# Altium project uAMDC.PrjPcb (part 2 of 3)

## Sheet InverterConnectors.SchDoc: Inverter Connectors
size Letter; Engineer: Nathan Petersen; DocumentNumber: 17; Revision: v1.2; SheetNumber: 17; SheetTotal: 26
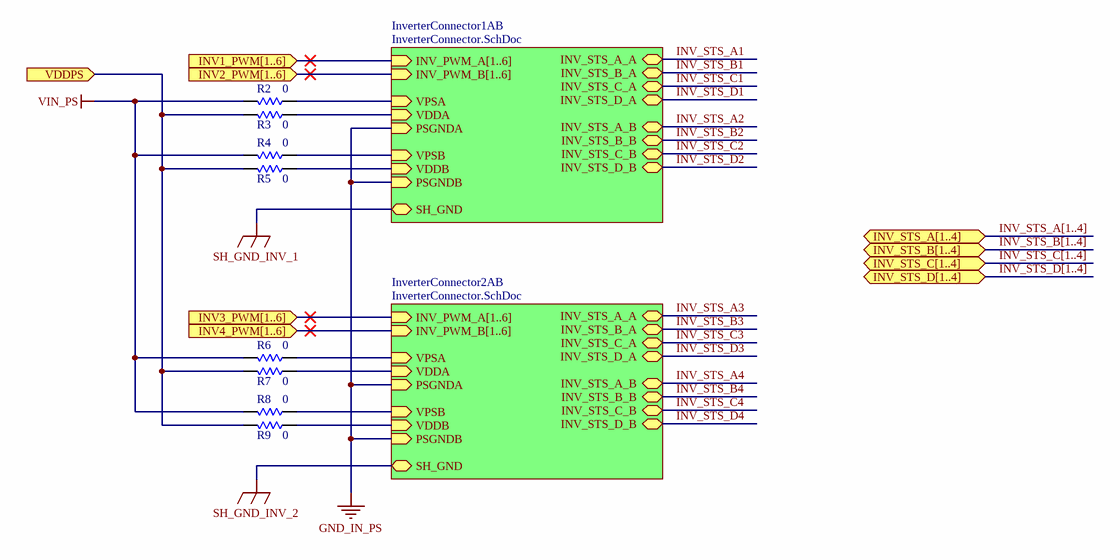
[diagram p11: InverterConnectors.SchDoc]

### Parts
R2  value 0  [1206-RES]  (hidden comment: Resistor)
R3  value 0  [1206-RES]  (hidden comment: Resistor)
R4  value 0  [1206-RES]  (hidden comment: Resistor)
R5  value 0  [1206-RES]  (hidden comment: Resistor)
R6  value 0  [1206-RES]  (hidden comment: Resistor)
R7  value 0  [1206-RES]  (hidden comment: Resistor)
R8  value 0  [1206-RES]  (hidden comment: Resistor)
R9  value 0  [1206-RES]  (hidden comment: Resistor)

### Sub-sheets
InverterConnector1AB = InverterConnector.SchDoc: INV_PWM_A[1..6] (in), INV_PWM_B[1..6] (in), SH_GND (bidir), INV_STS_A_B (bidir), INV_STS_A_A (bidir), INV_STS_B_A (bidir), INV_STS_C_A (bidir), INV_STS_D_A (bidir), INV_STS_B_B (bidir), INV_STS_C_B (bidir), INV_STS_D_B (bidir), VPSA (in), VDDA (in), PSGNDA (in), VPSB (in), VDDB (in), PSGNDB (in)
InverterConnector2AB = InverterConnector.SchDoc: INV_PWM_A[1..6] (in), INV_PWM_B[1..6] (in), SH_GND (bidir), INV_STS_A_B (bidir), INV_STS_A_A (bidir), INV_STS_B_A (bidir), INV_STS_C_A (bidir), INV_STS_D_A (bidir), INV_STS_B_B (bidir), INV_STS_C_B (bidir), INV_STS_D_B (bidir), VPSA (in), VDDA (in), PSGNDA (in), VPSB (in), VDDB (in), PSGNDB (in)

### Ports
INV1_PWM[1..6] (in), INV2_PWM[1..6] (in), INV3_PWM[1..6] (in), INV4_PWM[1..6] (in), INV_STS_A[1..4] (bidir), INV_STS_B[1..4] (bidir), INV_STS_C[1..4] (bidir), INV_STS_D[1..4] (bidir), VDDPS (in)

### Nets
GND_IN_PS: sheet InverterConnector1AB/PSGNDA, sheet InverterConnector1AB/PSGNDB, sheet InverterConnector2AB/PSGNDA, sheet InverterConnector2AB/PSGNDB
VIN_PS: R2.2 R4.2 R6.2 R8.2
VDDPS: R3.2 R5.2 R7.2 R9.2 ; port VDDPS
NetCON3A_12A: R2.1 ; sheet InverterConnector1AB/VPSA
NetCON3A_12B: R4.1 ; sheet InverterConnector1AB/VPSB
NetCON3A_13A: R3.1 ; sheet InverterConnector1AB/VDDA
NetCON3A_13B: R5.1 ; sheet InverterConnector1AB/VDDB
NetCON3B_12A: R6.1 ; sheet InverterConnector2AB/VPSA
NetCON3B_12B: R8.1 ; sheet InverterConnector2AB/VPSB
NetCON3B_13A: R7.1 ; sheet InverterConnector2AB/VDDA
NetCON3B_13B: R9.1 ; sheet InverterConnector2AB/VDDB

### Buses and harness runs
bus INV_STS_A[1..4] = port INV_STS_A[1..4]
bus INV_STS_B[1..4] = port INV_STS_B[1..4]
bus INV_STS_C[1..4] = port INV_STS_C[1..4]
bus INV_STS_D[1..4] = port INV_STS_D[1..4]
bus port INV1_PWM[1..6] = sheet InverterConnector1AB/INV_PWM_A[1..6]
bus port INV2_PWM[1..6] = sheet InverterConnector1AB/INV_PWM_B[1..6]
bus port INV3_PWM[1..6] = sheet InverterConnector2AB/INV_PWM_A[1..6]
bus port INV4_PWM[1..6] = sheet InverterConnector2AB/INV_PWM_B[1..6]

### Notes on the sheet
- Title:
- File:
- Sheet:
- of
- Revision:
- Time:
- Date:
- Engineer:

### Library data of the parts
R2-R9 = Resistor: Supplier 1: Digi-Key; Supplier Part Number 1: 311-0.0ERCT-ND

## Sheet InverterConnector.SchDoc: Inverter Connector
size Letter; Engineer: Nathan Petersen; DocumentNumber: 18; Revision: v1.2; SheetNumber: 18; SheetTotal: 26
Used 2 times, as channels U_FPGA/U_DriveInterface/U_InverterConnectors/InverterConnector1AB, U_FPGA/U_DriveInterface/U_InverterConnectors/InverterConnector2AB. Parts and nets are listed once, with the designators drawn on the sheet.
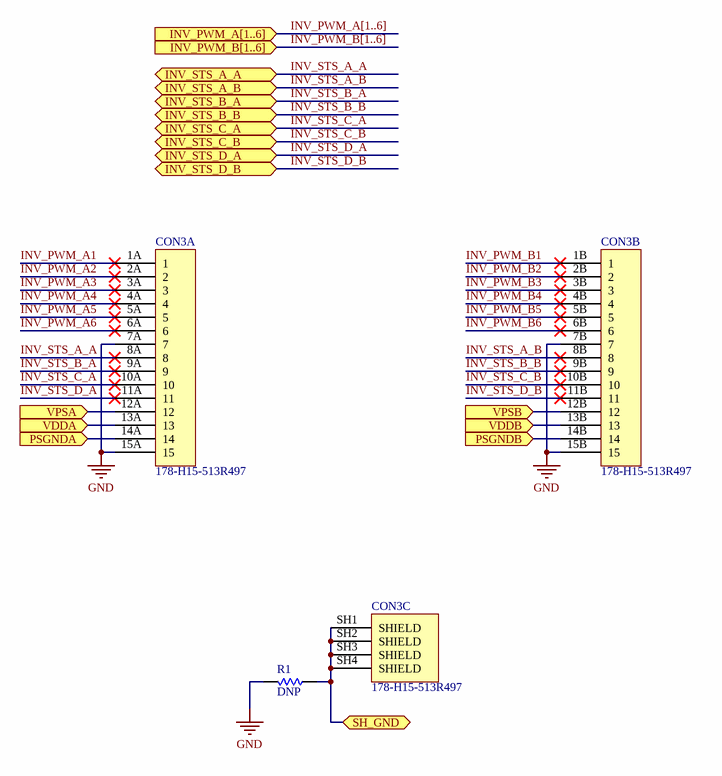
[diagram p12: InverterConnector.SchDoc]

### Parts
CON3  178-H15-513R497  [178-H15-513R497]  (parts A,B,C of 3)
R1  value DNP  [0603-RES]  (hidden comment: Resistor)

### Ports
INV_PWM_A[1..6] (in), INV_PWM_B[1..6] (in), INV_STS_A_A (bidir), INV_STS_A_B (bidir), INV_STS_B_A (bidir), INV_STS_B_B (bidir), INV_STS_C_A (bidir), INV_STS_C_B (bidir), INV_STS_D_A (bidir), INV_STS_D_B (bidir), PSGNDA (in), PSGNDB (in), SH_GND (bidir), VDDA (in), VDDB (in), VPSA (in), VPSB (in)

### Nets
GND: CON3.7A(7) CON3.7B(7) CON3.15A(15) CON3.15B(15) R1.2
INV_PWM_A1: CON3.1A(1)
INV_PWM_A2: CON3.2A(2)
INV_PWM_A3: CON3.3A(3)
INV_PWM_A4: CON3.4A(4)
INV_PWM_A5: CON3.5A(5)
INV_PWM_A6: CON3.6A(6)
INV_PWM_B1: CON3.1B(1)
INV_PWM_B2: CON3.2B(2)
INV_PWM_B3: CON3.3B(3)
INV_PWM_B4: CON3.4B(4)
INV_PWM_B5: CON3.5B(5)
INV_PWM_B6: CON3.6B(6)
INV_STS_A_A: CON3.8A(8) ; port INV_STS_A_A
INV_STS_A_B: CON3.8B(8) ; port INV_STS_A_B
INV_STS_B_A: CON3.9A(9) ; port INV_STS_B_A
INV_STS_B_B: CON3.9B(9) ; port INV_STS_B_B
INV_STS_C_A: CON3.10A(10) ; port INV_STS_C_A
INV_STS_C_B: CON3.10B(10) ; port INV_STS_C_B
INV_STS_D_A: CON3.11A(11) ; port INV_STS_D_A
INV_STS_D_B: CON3.11B(11) ; port INV_STS_D_B
PSGNDA: CON3.14A(14) ; port PSGNDA
PSGNDB: CON3.14B(14) ; port PSGNDB
SH_GND: CON3.SH1(SHIELD) CON3.SH2(SHIELD) CON3.SH3(SHIELD) CON3.SH4(SHIELD) R1.1 ; port SH_GND
VDDA: CON3.13A(13) ; port VDDA
VDDB: CON3.13B(13) ; port VDDB
VPSA: CON3.12A(12) ; port VPSA
VPSB: CON3.12B(12) ; port VPSB

### Channels
U_FPGA/U_DriveInterface/U_InverterConnectors/InverterConnector1AB: designators end in A; ports INV_STS_A_A=INV_STS_A1 INV_STS_A_B=INV_STS_A2 INV_STS_B_A=INV_STS_B1 INV_STS_B_B=INV_STS_B2 INV_STS_C_A=INV_STS_C1 INV_STS_C_B=INV_STS_C2 INV_STS_D_A=INV_STS_D1 INV_STS_D_B=INV_STS_D2 PSGNDA=GND_IN_PS PSGNDB=GND_IN_PS SH_GND=SH_GND_INV_1 VDDA=NetCON3A_13A VDDB=NetCON3A_13B VPSA=NetCON3A_12A VPSB=NetCON3A_12B
U_FPGA/U_DriveInterface/U_InverterConnectors/InverterConnector2AB: designators end in B; ports INV_STS_A_A=INV_STS_A3 INV_STS_A_B=INV_STS_A4 INV_STS_B_A=INV_STS_B3 INV_STS_B_B=INV_STS_B4 INV_STS_C_A=INV_STS_C3 INV_STS_C_B=INV_STS_C4 INV_STS_D_A=INV_STS_D3 INV_STS_D_B=INV_STS_D4 PSGNDA=GND_IN_PS PSGNDB=GND_IN_PS SH_GND=SH_GND_INV_2 VDDA=NetCON3B_13A VDDB=NetCON3B_13B VPSA=NetCON3B_12A VPSB=NetCON3B_12B

### Buses and harness runs
bus INV_PWM_A[1..6] = port INV_PWM_A[1..6]
bus INV_PWM_B[1..6] = port INV_PWM_B[1..6]

### Notes on the sheet
- Title:
- File:
- Sheet:
- of
- Revision:
- Time:
- Date:
- Engineer:

### Library data of the parts
CON3 = 178-H15-513R497: CONN D-SUB RCPT/RCPT 15/15POS RA; Supplier 1: Digi-Key; Supplier Part Number 1: NOR1832-ND
R1 = Resistor: Supplier 1: Digi-Key; Supplier Part Number 1: P0.0GCT-ND

## Sheet InverterTranslation.SchDoc: Inverter Level Translation
size 279 x 215 mm; Engineer: Prasoon Sinha; DocumentNumber: 19; SheetNumber: 19; SheetTotal: 26
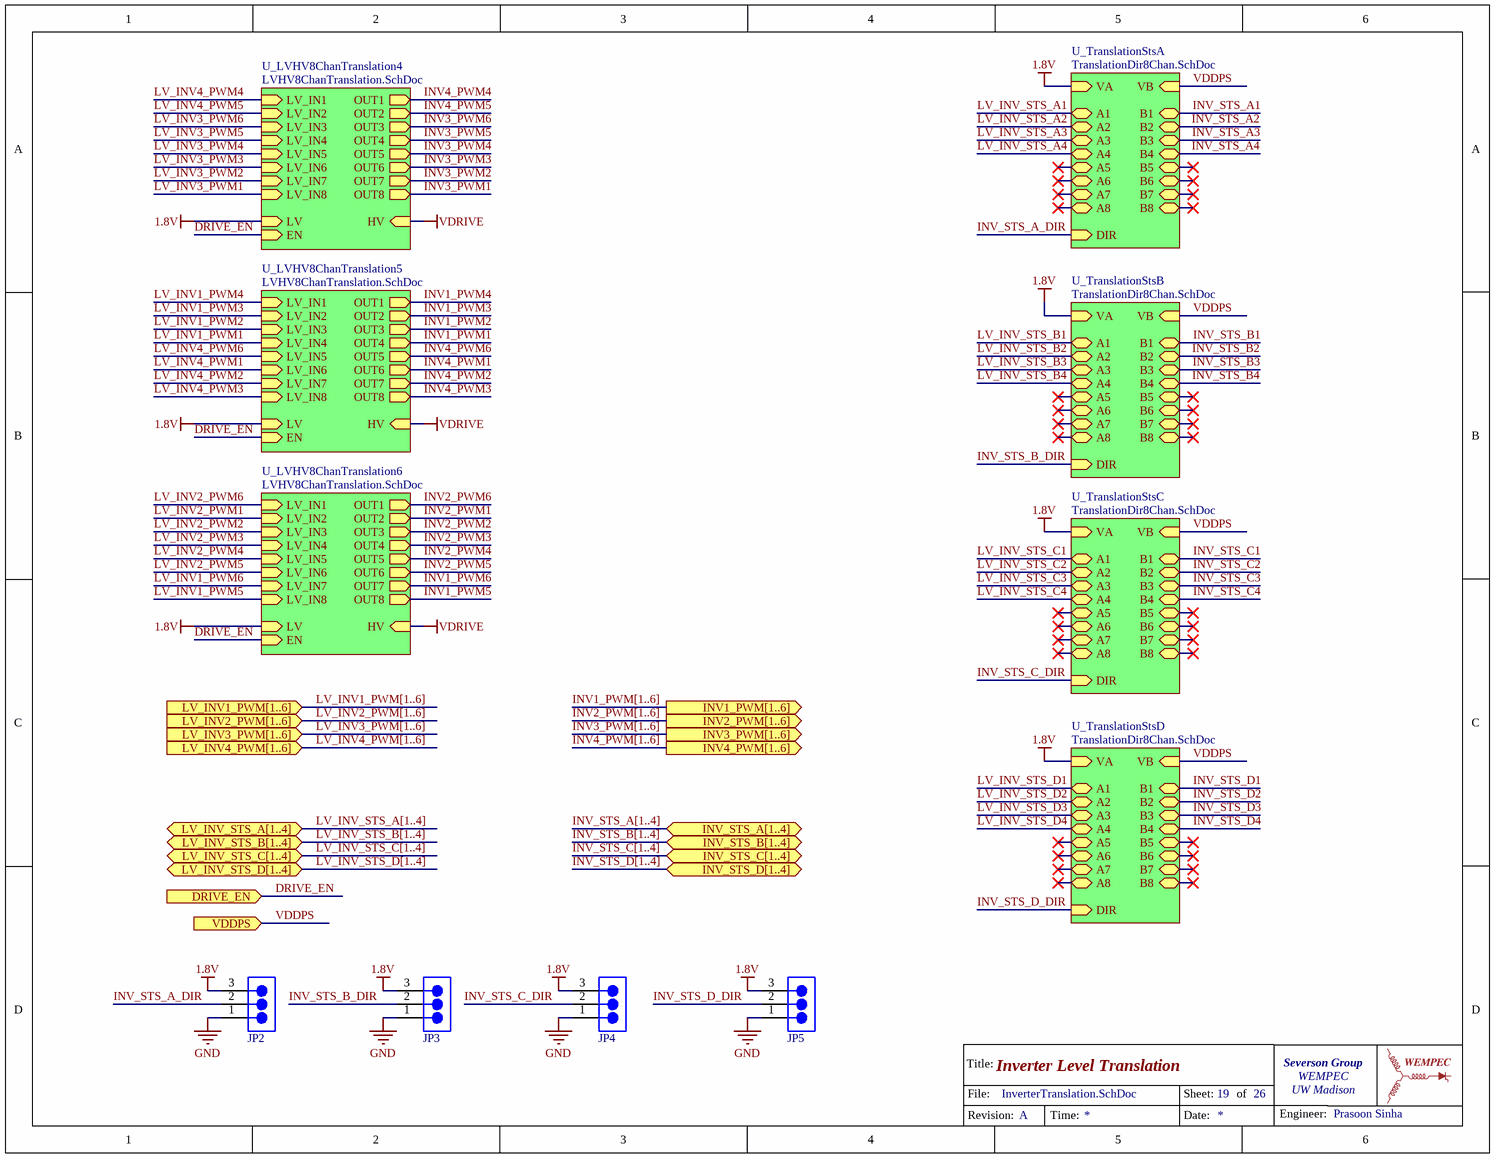
[diagram p13: InverterTranslation.SchDoc]

### Parts
(Parts that share a designator on the sheet are numbered #1, #2 ... from top to bottom, then left to right.)
*?#8  TitleBlockWEMPEC  (value not drawn)  (graphical)
JP2  Jumper3  [PIN_HEADER_1X3]  (value not drawn)
JP3  Jumper3  [PIN_HEADER_1X3]  (value not drawn)
JP4  Jumper3  [PIN_HEADER_1X3]  (value not drawn)
JP5  Jumper3  [PIN_HEADER_1X3]  (value not drawn)

### Sub-sheets
U_LVHV8ChanTranslation4 = LVHV8ChanTranslation.SchDoc: LV_IN1 (in), LV (in), HV (in), EN (in), OUT1 (out), OUT2 (out), OUT3 (out), OUT4 (out), LV_IN2 (in), LV_IN3 (in), LV_IN4 (in), LV_IN5 (in), LV_IN6 (in), LV_IN7 (in), LV_IN8 (in), OUT5 (out), OUT6 (out), OUT7 (out), OUT8 (out)
U_LVHV8ChanTranslation5 = LVHV8ChanTranslation.SchDoc: LV_IN1 (in), LV (in), HV (in), EN (in), OUT1 (out), OUT2 (out), OUT3 (out), OUT4 (out), LV_IN2 (in), LV_IN3 (in), LV_IN4 (in), LV_IN5 (in), LV_IN6 (in), LV_IN7 (in), LV_IN8 (in), OUT5 (out), OUT6 (out), OUT7 (out), OUT8 (out)
U_LVHV8ChanTranslation6 = LVHV8ChanTranslation.SchDoc: LV_IN1 (in), LV (in), HV (in), EN (in), OUT1 (out), OUT2 (out), OUT3 (out), OUT4 (out), LV_IN2 (in), LV_IN3 (in), LV_IN4 (in), LV_IN5 (in), LV_IN6 (in), LV_IN7 (in), LV_IN8 (in), OUT5 (out), OUT6 (out), OUT7 (out), OUT8 (out)
U_TranslationStsA = TranslationDir8Chan.SchDoc: VB (in), VA (in), B1 (bidir), B2 (bidir), B3 (bidir), B4 (bidir), A1 (bidir), A2 (bidir), A3 (bidir), A4 (bidir), DIR (in), B6 (bidir), A7 (bidir), B5 (bidir), A5 (bidir), B7 (bidir), A8 (bidir), A6 (bidir), B8 (bidir)
U_TranslationStsB = TranslationDir8Chan.SchDoc: VB (in), VA (in), B1 (bidir), B2 (bidir), B3 (bidir), B4 (bidir), A1 (bidir), A2 (bidir), A3 (bidir), A4 (bidir), DIR (in), B6 (bidir), A7 (bidir), B5 (bidir), A5 (bidir), B7 (bidir), A8 (bidir), A6 (bidir), B8 (bidir)
U_TranslationStsC = TranslationDir8Chan.SchDoc: VB (in), VA (in), B1 (bidir), B2 (bidir), B3 (bidir), B4 (bidir), A1 (bidir), A2 (bidir), A3 (bidir), A4 (bidir), DIR (in), B6 (bidir), A7 (bidir), B5 (bidir), A5 (bidir), B7 (bidir), A8 (bidir), A6 (bidir), B8 (bidir)
U_TranslationStsD = TranslationDir8Chan.SchDoc: VB (in), VA (in), B1 (bidir), B2 (bidir), B3 (bidir), B4 (bidir), A1 (bidir), A2 (bidir), A3 (bidir), A4 (bidir), DIR (in), B6 (bidir), A7 (bidir), B5 (bidir), A5 (bidir), B7 (bidir), A8 (bidir), A6 (bidir), B8 (bidir)

### Ports
DRIVE_EN (in), INV1_PWM[1..6] (out), INV2_PWM[1..6] (out), INV3_PWM[1..6] (out), INV4_PWM[1..6] (out), INV_STS_A[1..4] (bidir), INV_STS_B[1..4] (bidir), INV_STS_C[1..4] (bidir), INV_STS_D[1..4] (bidir), LV_INV1_PWM[1..6] (in), LV_INV2_PWM[1..6] (in), LV_INV3_PWM[1..6] (in), LV_INV4_PWM[1..6] (in), LV_INV_STS_A[1..4] (bidir), LV_INV_STS_B[1..4] (bidir), LV_INV_STS_C[1..4] (bidir), LV_INV_STS_D[1..4] (bidir), VDDPS (in)

### Nets
1.8V: JP2.3 JP3.3 JP4.3 JP5.3 ; sheet U_LVHV8ChanTranslation4/LV, sheet U_LVHV8ChanTranslation5/LV, sheet U_LVHV8ChanTranslation6/LV, sheet U_TranslationStsA/VA, sheet U_TranslationStsB/VA, sheet U_TranslationStsC/VA, sheet U_TranslationStsD/VA
GND: JP2.1 JP3.1 JP4.1 JP5.1
VDRIVE: sheet U_LVHV8ChanTranslation4/HV, sheet U_LVHV8ChanTranslation5/HV, sheet U_LVHV8ChanTranslation6/HV
DRIVE_EN: port DRIVE_EN, sheet U_LVHV8ChanTranslation4/EN, sheet U_LVHV8ChanTranslation5/EN, sheet U_LVHV8ChanTranslation6/EN
INV_STS_A_DIR: JP2.2 ; sheet U_TranslationStsA/DIR
INV_STS_B_DIR: JP3.2 ; sheet U_TranslationStsB/DIR
INV_STS_C_DIR: JP4.2 ; sheet U_TranslationStsC/DIR
INV_STS_D_DIR: JP5.2 ; sheet U_TranslationStsD/DIR
VDDPS: port VDDPS, sheet U_TranslationStsA/VB, sheet U_TranslationStsB/VB, sheet U_TranslationStsC/VB, sheet U_TranslationStsD/VB

### Buses and harness runs
bus INV1_PWM[1..6] = port INV1_PWM[1..6]
bus INV2_PWM[1..6] = port INV2_PWM[1..6]
bus INV3_PWM[1..6] = port INV3_PWM[1..6]
bus INV4_PWM[1..6] = port INV4_PWM[1..6]
bus INV_STS_A[1..4] = port INV_STS_A[1..4]
bus INV_STS_B[1..4] = port INV_STS_B[1..4]
bus INV_STS_C[1..4] = port INV_STS_C[1..4]
bus INV_STS_D[1..4] = port INV_STS_D[1..4]
bus LV_INV1_PWM[1..6] = port LV_INV1_PWM[1..6]
bus LV_INV2_PWM[1..6] = port LV_INV2_PWM[1..6]
bus LV_INV3_PWM[1..6] = port LV_INV3_PWM[1..6]
bus LV_INV4_PWM[1..6] = port LV_INV4_PWM[1..6]
bus LV_INV_STS_A[1..4] = port LV_INV_STS_A[1..4]
bus LV_INV_STS_B[1..4] = port LV_INV_STS_B[1..4]
bus LV_INV_STS_C[1..4] = port LV_INV_STS_C[1..4]
bus LV_INV_STS_D[1..4] = port LV_INV_STS_D[1..4]

### Notes on the sheet
- (in symbol TitleBlockWEMPEC) Title:; File:; Sheet:; of; Engineer:; Revision:; Time:; Date:

### Library data of the parts
JP2-JP5 = Jumper3: Supplier 1: Digi-Key; Supplier Part Number 1: 732-5316-ND

## Sheet LVHV8ChanTranslation.SchDoc: 8-channel LV to HV Translation
size Letter; Engineer: Prasoon Sinha; DocumentNumber: 20; Revision: v1.2; SheetNumber: 20; SheetTotal: 26
Used 3 times, as channels U_FPGA/U_DriveInterface/U_InverterTranslation/U_LVHV8ChanTranslation4, U_FPGA/U_DriveInterface/U_InverterTranslation/U_LVHV8ChanTranslation5, U_FPGA/U_DriveInterface/U_InverterTranslation/U_LVHV8ChanTranslation6. Parts and nets are listed once, with the designators drawn on the sheet.
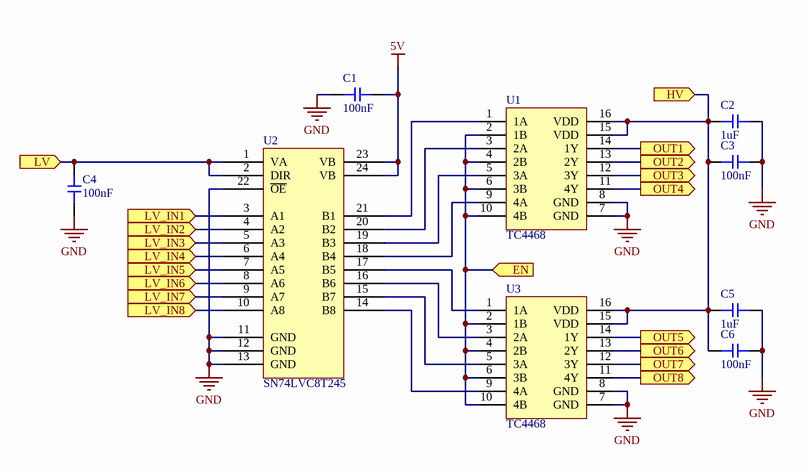
[diagram p14: LVHV8ChanTranslation.SchDoc]

### Parts
C1  value 100nF  [0603-CAP]  (hidden comment: Capacitor)
C2  value 1uF  [0603-CAP]  (hidden comment: Capacitor)
C3  value 100nF  [0603-CAP]  (hidden comment: Capacitor)
C4  value 100nF  [0603-CAP]  (hidden comment: Capacitor)
C5  value 1uF  [0603-CAP]  (hidden comment: Capacitor)
C6  value 100nF  [0603-CAP]  (hidden comment: Capacitor)
U1  TC4468  [SOIC16_N - wide]
U2  SN74LVC8T245  [TSOP65P640X120-24N]
U3  TC4468  [SOIC16_N - wide]

### Ports
EN (in), HV (in), LV (in), LV_IN1 (in), LV_IN2 (in), LV_IN3 (in), LV_IN4 (in), LV_IN5 (in), LV_IN6 (in), LV_IN7 (in), LV_IN8 (in), OUT1 (out), OUT2 (out), OUT3 (out), OUT4 (out), OUT5 (out), OUT6 (out), OUT7 (out), OUT8 (out)

### Nets
5V: C1.1 U2.23(VB) U2.24(VB)
GND: C1.2 C2.2 C3.2 C4.1 C5.2 C6.2 U1.7(GND) U1.8(GND) U2.11(GND) U2.12(GND) U2.13(GND) U2.22(~{OE}) U3.7(GND) U3.8(GND)
EN: U1.2(1B) U1.4(2B) U1.6(3B) U1.10(4B) U3.2(1B) U3.4(2B) U3.6(3B) U3.10(4B) ; port EN
HV: C2.1 C3.1 C5.1 C6.1 U1.15(VDD) U1.16(VDD) U3.15(VDD) U3.16(VDD) ; port HV
LV: C4.2 U2.1(VA) U2.2(DIR) ; port LV
LV_IN1: U2.3(A1) ; port LV_IN1
LV_IN2: U2.4(A2) ; port LV_IN2
LV_IN3: U2.5(A3) ; port LV_IN3
LV_IN4: U2.6(A4) ; port LV_IN4
LV_IN5: U2.7(A5) ; port LV_IN5
LV_IN6: U2.8(A6) ; port LV_IN6
LV_IN7: U2.9(A7) ; port LV_IN7
LV_IN8: U2.10(A8) ; port LV_IN8
OUT1: U1.14(1Y) ; port OUT1
OUT2: U1.13(2Y) ; port OUT2
OUT3: U1.12(3Y) ; port OUT3
OUT4: U1.11(4Y) ; port OUT4
OUT5: U3.14(1Y) ; port OUT5
OUT6: U3.13(2Y) ; port OUT6
OUT7: U3.12(3Y) ; port OUT7
OUT8: U3.11(4Y) ; port OUT8
NetU1_1: U1.1(1A) U2.21(B1)
NetU1_3: U1.3(2A) U2.20(B2)
NetU1_5: U1.5(3A) U2.19(B3)
NetU1_9: U1.9(4A) U2.18(B4)
NetU2_14: U2.14(B8) U3.9(4A)
NetU2_15: U2.15(B7) U3.5(3A)
NetU2_16: U2.16(B6) U3.3(2A)
NetU2_17: U2.17(B5) U3.1(1A)

### Channels
U_FPGA/U_DriveInterface/U_InverterTranslation/U_LVHV8ChanTranslation4: designators end in A; ports EN=DRIVE_EN HV=VDRIVE LV=1.8V LV_IN1=LV_INV4_PWM4 LV_IN2=LV_INV4_PWM5 LV_IN3=LV_INV3_PWM6 LV_IN4=LV_INV3_PWM5 LV_IN5=LV_INV3_PWM4 LV_IN6=LV_INV3_PWM3 LV_IN7=LV_INV3_PWM2 LV_IN8=LV_INV3_PWM1 OUT1=INV4_PWM4 OUT2=INV4_PWM5 OUT3=INV3_PWM6 OUT4=INV3_PWM5 OUT5=INV3_PWM4 OUT6=INV3_PWM3 OUT7=INV3_PWM2 OUT8=INV3_PWM1
U_FPGA/U_DriveInterface/U_InverterTranslation/U_LVHV8ChanTranslation5: designators end in B; ports EN=DRIVE_EN HV=VDRIVE LV=1.8V LV_IN1=LV_INV1_PWM4 LV_IN2=LV_INV1_PWM3 LV_IN3=LV_INV1_PWM2 LV_IN4=LV_INV1_PWM1 LV_IN5=LV_INV4_PWM6 LV_IN6=LV_INV4_PWM1 LV_IN7=LV_INV4_PWM2 LV_IN8=LV_INV4_PWM3 OUT1=INV1_PWM4 OUT2=INV1_PWM3 OUT3=INV1_PWM2 OUT4=INV1_PWM1 OUT5=INV4_PWM6 OUT6=INV4_PWM1 OUT7=INV4_PWM2 OUT8=INV4_PWM3
U_FPGA/U_DriveInterface/U_InverterTranslation/U_LVHV8ChanTranslation6: designators end in C; ports EN=DRIVE_EN HV=VDRIVE LV=1.8V LV_IN1=LV_INV2_PWM6 LV_IN2=LV_INV2_PWM1 LV_IN3=LV_INV2_PWM2 LV_IN4=LV_INV2_PWM3 LV_IN5=LV_INV2_PWM4 LV_IN6=LV_INV2_PWM5 LV_IN7=LV_INV1_PWM6 LV_IN8=LV_INV1_PWM5 OUT1=INV2_PWM6 OUT2=INV2_PWM1 OUT3=INV2_PWM2 OUT4=INV2_PWM3 OUT5=INV2_PWM4 OUT6=INV2_PWM5 OUT7=INV1_PWM6 OUT8=INV1_PWM5

### Notes on the sheet
- Title:
- File:
- Sheet:
- of
- Revision:
- Time:
- Date:
- Engineer:

### Library data of the parts
U1 U3 = TC4468: IC MOSFET DVR QUAD AND 16SOIC; Supplier 1: Digi-Key; Supplier Part Number 1: TC4468COE-ND
U2 = SN74LVC8T245PWR: IC BUS TRANSCVR 8BIT 24TSSOP; Supplier 1: Digi-Key; Supplier Part Number 1: 296-18593-1-ND
C1-C6 = Capacitor: Supplier 1: Digi-Key
  C1 C3 C4 C6: Supplier Part Number 1: 1276-1012-1-ND
  C2 C5: Supplier Part Number 1: 1276-6524-1-ND

## Sheet AnalogInterface.SchDoc: Analog Interface
size Letter; Engineer: Nathan Petersen; DocumentNumber: 11; Revision: v1.2; SheetNumber: 11; SheetTotal: 26
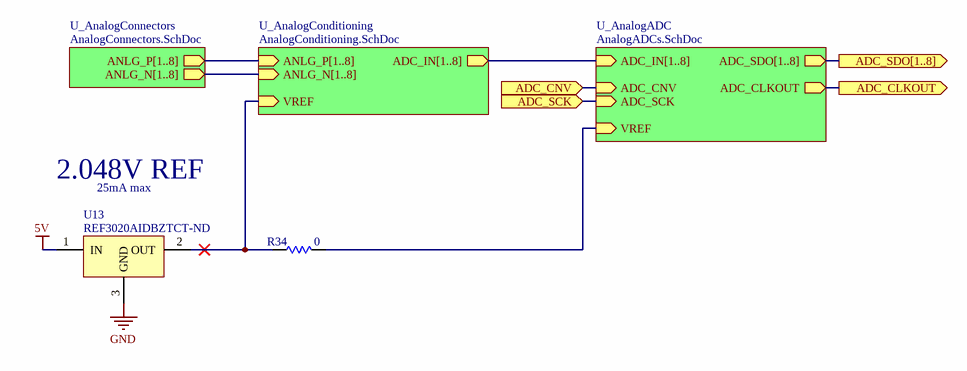
[diagram p15: AnalogInterface.SchDoc]

### Parts
R34  value 0  [1206-RES]  (hidden comment: Resistor)
U13  Supplier Part Number 1: REF3020AIDBZTCT-ND  [SOT23-3]  (hidden comment: REF3020AIDBZT)

### Sub-sheets
U_AnalogADC = AnalogADCs.SchDoc: ADC_IN[1..8] (in), ADC_SDO[1..8] (out), ADC_CNV (in), ADC_SCK (in), ADC_CLKOUT (out), VREF (in)
U_AnalogConditioning = AnalogConditioning.SchDoc: ADC_IN[1..8] (out), ANLG_N[1..8] (in), ANLG_P[1..8] (in), VREF (in)
U_AnalogConnectors = AnalogConnectors.SchDoc: ANLG_P[1..8] (out), ANLG_N[1..8] (out)

### Ports
ADC_CLKOUT (out), ADC_CNV (in), ADC_SCK (in), ADC_SDO[1..8] (out)

### Nets
5V: U13.1(IN)
GND: U13.3(GND)
ADC_CLKOUT: port ADC_CLKOUT, sheet U_AnalogADC/ADC_CLKOUT
ADC_CNV: port ADC_CNV, sheet U_AnalogADC/ADC_CNV
ADC_SCK: port ADC_SCK, sheet U_AnalogADC/ADC_SCK
VREF: R34.2 ; sheet U_AnalogADC/VREF
NetR21_1: R34.1 U13.2(OUT) ; sheet U_AnalogConditioning/VREF

### Buses and harness runs
bus port ADC_SDO[1..8] = sheet U_AnalogADC/ADC_SDO[1..8]
bus sheet U_AnalogADC/ADC_IN[1..8] = sheet U_AnalogConditioning/ADC_IN[1..8]
bus sheet U_AnalogConditioning/ANLG_N[1..8] = sheet U_AnalogConnectors/ANLG_N[1..8]
bus sheet U_AnalogConditioning/ANLG_P[1..8] = sheet U_AnalogConnectors/ANLG_P[1..8]

### Notes on the sheet
- 2.048V REF
- 25mA max
- Title:
- File:
- Sheet:
- of
- Revision:
- Time:
- Date:
- Engineer:

### Library data of the parts
U13 = REF3020AIDBZT: Series Voltage Reference IC ±0.2% 25mA SOT-23-3; Supplier 1: Digi-Key
R34 = Resistor: Supplier 1: Digi-Key; Supplier Part Number 1: 311-0.0ERCT-ND

## Sheet AnalogADCs.SchDoc: ADC
size Letter; Engineer: Nathan Petersen; DocumentNumber: 12; Revision: v1.2; SheetNumber: 12; SheetTotal: 26
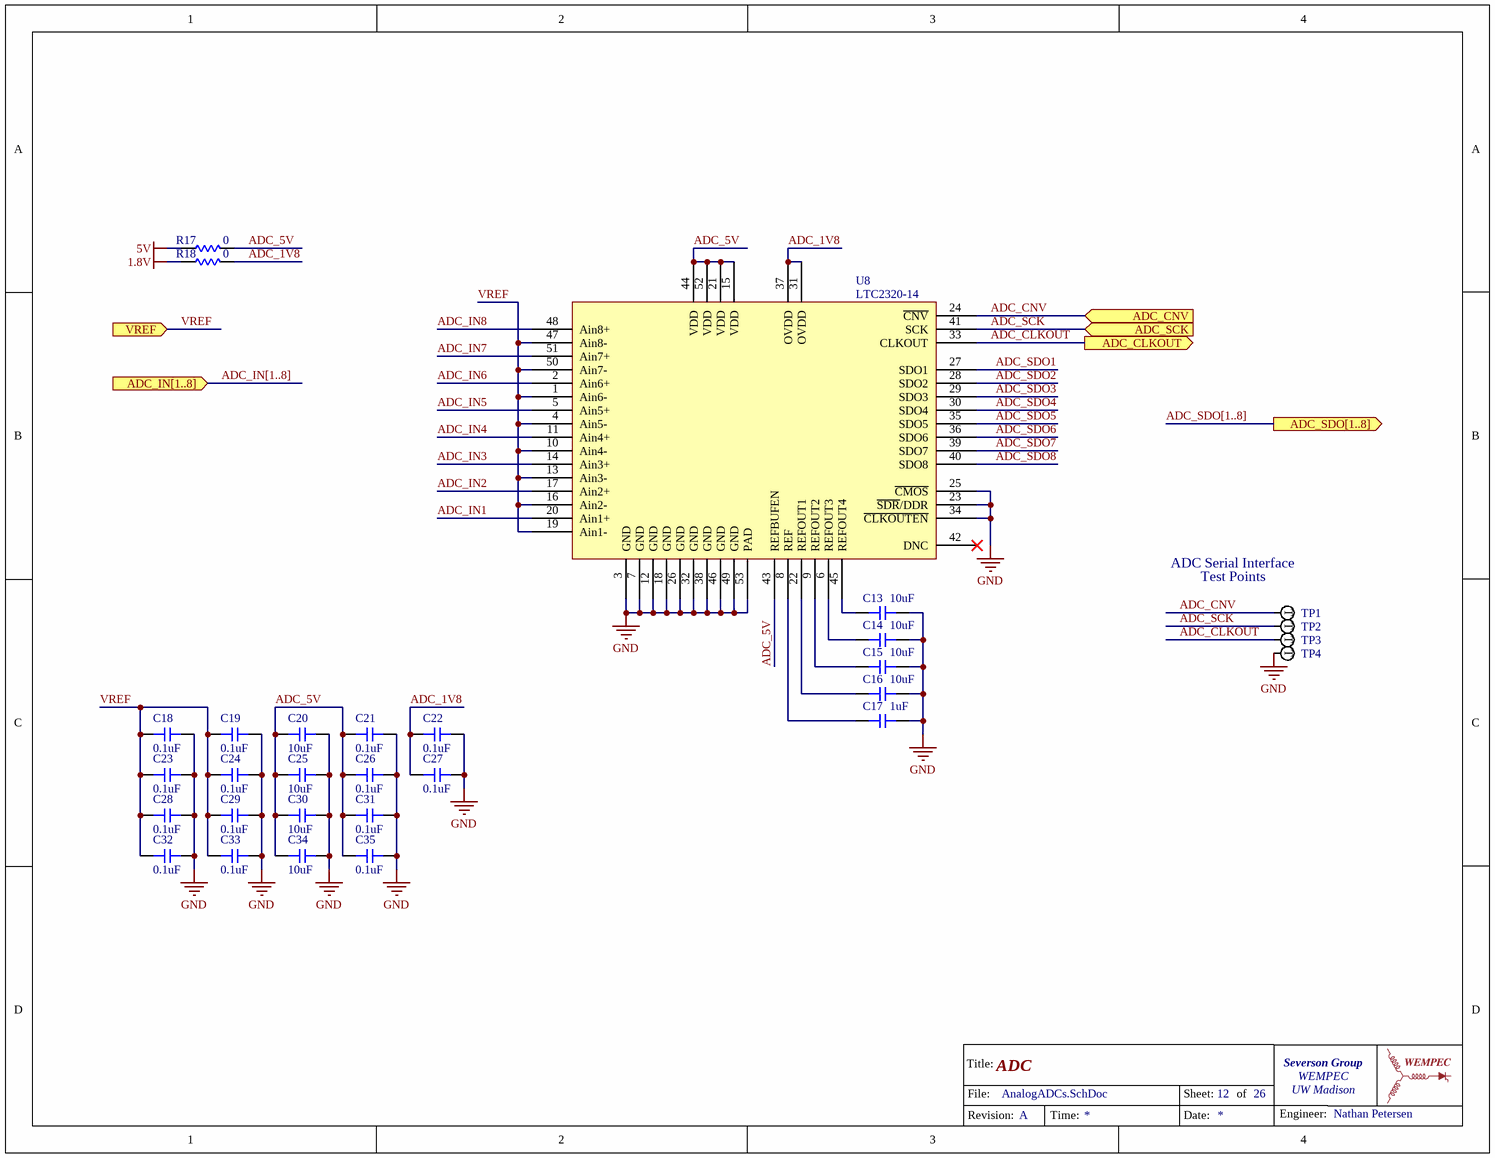
[diagram p16: AnalogADCs.SchDoc]

### Parts
C13  value 10uF  [0603-CAP]  (hidden comment: Capacitor)
C14  value 10uF  [0603-CAP]  (hidden comment: Capacitor)
C15  value 10uF  [0603-CAP]  (hidden comment: Capacitor)
C16  value 10uF  [0603-CAP]  (hidden comment: Capacitor)
C17  value 1uF  [0603-CAP]  (hidden comment: Capacitor)
C18  value 0.1uF  [0603-CAP]  (hidden comment: Capacitor)
C19  value 0.1uF  [0603-CAP]  (hidden comment: Capacitor)
C20  value 10uF  [0603-CAP]  (hidden comment: Capacitor)
C21  value 0.1uF  [0603-CAP]  (hidden comment: Capacitor)
C22  value 0.1uF  [0603-CAP]  (hidden comment: Capacitor)
C23  value 0.1uF  [0603-CAP]  (hidden comment: Capacitor)
C24  value 0.1uF  [0603-CAP]  (hidden comment: Capacitor)
C25  value 10uF  [0603-CAP]  (hidden comment: Capacitor)
C26  value 0.1uF  [0603-CAP]  (hidden comment: Capacitor)
C27  value 0.1uF  [0603-CAP]  (hidden comment: Capacitor)
C28  value 0.1uF  [0603-CAP]  (hidden comment: Capacitor)
C29  value 0.1uF  [0603-CAP]  (hidden comment: Capacitor)
C30  value 10uF  [0603-CAP]  (hidden comment: Capacitor)
C31  value 0.1uF  [0603-CAP]  (hidden comment: Capacitor)
C32  value 0.1uF  [0603-CAP]  (hidden comment: Capacitor)
C33  value 0.1uF  [0603-CAP]  (hidden comment: Capacitor)
C34  value 10uF  [0603-CAP]  (hidden comment: Capacitor)
C35  value 0.1uF  [0603-CAP]  (hidden comment: Capacitor)
R17  value 0  [1206-RES]  (hidden comment: Resistor)
R18  value 0  [1206-RES]  (hidden comment: Resistor)
TP1  Test Point  [RCU-0C]  (value not drawn)
TP2  Test Point  [RCU-0C]  (value not drawn)
TP3  Test Point  [RCU-0C]  (value not drawn)
TP4  Test Point  [RCU-0C]  (value not drawn)
U8  LTC2320-14  [QFN50P700X800X80_HS-53N]

### Ports
ADC_CLKOUT (out), ADC_CNV (in), ADC_IN[1..8] (in), ADC_SCK (in), ADC_SDO[1..8] (out), VREF (in)

### Nets
1.8V: R18.1
5V: R17.1
GND: C13.2 C14.2 C15.2 C16.2 C17.2 C18.2 C19.2 C20.2 C21.2 C22.2 C23.2 C24.2 C25.2 C26.2 C27.2 C28.2 C29.2 C30.2 C31.2 C32.2 C33.2 C34.2 C35.2 TP4.1 U8.3(GND) U8.7(GND) U8.12(GND) U8.18(GND) U8.23(~{SDR}/DDR) U8.25(~{CMOS}) U8.26(GND) U8.32(GND) U8.34(~{CLKOUTEN}) U8.38(GND) U8.46(GND) U8.49(GND) U8.53(PAD)
ADC_1V8: C22.1 C27.1 R18.2 U8.31(OVDD) U8.37(OVDD)
ADC_5V: C20.1 C21.1 C25.1 C26.1 C30.1 C31.1 C34.1 C35.1 R17.2 U8.15(VDD) U8.21(VDD) U8.43(REFBUFEN) U8.44(VDD) U8.52(VDD)
ADC_CLKOUT: TP3.1 U8.33(CLKOUT) ; port ADC_CLKOUT
ADC_CNV: TP1.1 U8.24(~{CNV}) ; port ADC_CNV
ADC_IN1: U8.20(Ain1+)
ADC_IN2: U8.17(Ain2+)
ADC_IN3: U8.14(Ain3+)
ADC_IN4: U8.11(Ain4+)
ADC_IN5: U8.5(Ain5+)
ADC_IN6: U8.2(Ain6+)
ADC_IN7: U8.51(Ain7+)
ADC_IN8: U8.48(Ain8+)
ADC_SCK: TP2.1 U8.41(SCK) ; port ADC_SCK
ADC_SDO1: U8.27(SDO1)
ADC_SDO2: U8.28(SDO2)
ADC_SDO3: U8.29(SDO3)
ADC_SDO4: U8.30(SDO4)
ADC_SDO5: U8.35(SDO5)
ADC_SDO6: U8.36(SDO6)
ADC_SDO7: U8.39(SDO7)
ADC_SDO8: U8.40(SDO8)
VREF: C18.1 C19.1 C23.1 C24.1 C28.1 C29.1 C32.1 C33.1 U8.1(Ain6-) U8.4(Ain5-) U8.10(Ain4-) U8.13(Ain3-) U8.16(Ain2-) U8.19(Ain1-) U8.47(Ain8-) U8.50(Ain7-) ; port VREF
NetC13_1: C13.1 U8.45(REFOUT4)
NetC14_1: C14.1 U8.6(REFOUT3)
NetC15_1: C15.1 U8.9(REFOUT2)
NetC16_1: C16.1 U8.22(REFOUT1)
NetC17_1: C17.1 U8.8(REF)

Not connected (* = marked no-connect by the designer): U8 42(DNC)*

### Buses and harness runs
bus ADC_IN[1..8] = port ADC_IN[1..8]
bus ADC_SDO[1..8] = port ADC_SDO[1..8]

### Notes on the sheet
- ADC Serial Interface
- Test Points
- Title:
- File:
- Sheet:
- of
- Revision:
- Time:
- Date:
- Engineer:
- (in symbol Test Point) T

### Library data of the parts
U8 = LTC2320-14: IC ADC 14BIT 1.5MSPS SAR 52QFN - 14 Bit Analog to Digital Converter 8 Input 4 SAR 52-QFN (7x8); Supplier 1: Digi-Key; Supplier Part Number 1: LTC2320CUKG-14#PBF-ND
C13-C35 = Capacitor: Supplier 1: Digi-Key
  C13: Supplier Part Number 1: 1276-1192-1-ND
  C14-C16 C20 C25 C30 C34: Supplier Part Number 1: 1276-1119-1-ND
  C17: Supplier Part Number 1: 1276-6524-1-ND
  C18 C19 C21-C24 C26-C29 C31-C33 C35: Supplier Part Number 1: 1276-1012-1-ND
R17 R18 = Resistor: Supplier 1: Digi-Key; Supplier Part Number 1: 311-0.0ERCT-ND
TP1-TP4 = Test Point: Footprint: *; Supplier 1: Digi-Key; Supplier Part Number 1: A106145CT-ND

## Sheet AnalogConnectors.SchDoc: Analog RJ45 Connectors
size Letter; Engineer: Nathan Petersen; DocumentNumber: 15; Revision: v1.2; SheetNumber: 15; SheetTotal: 26
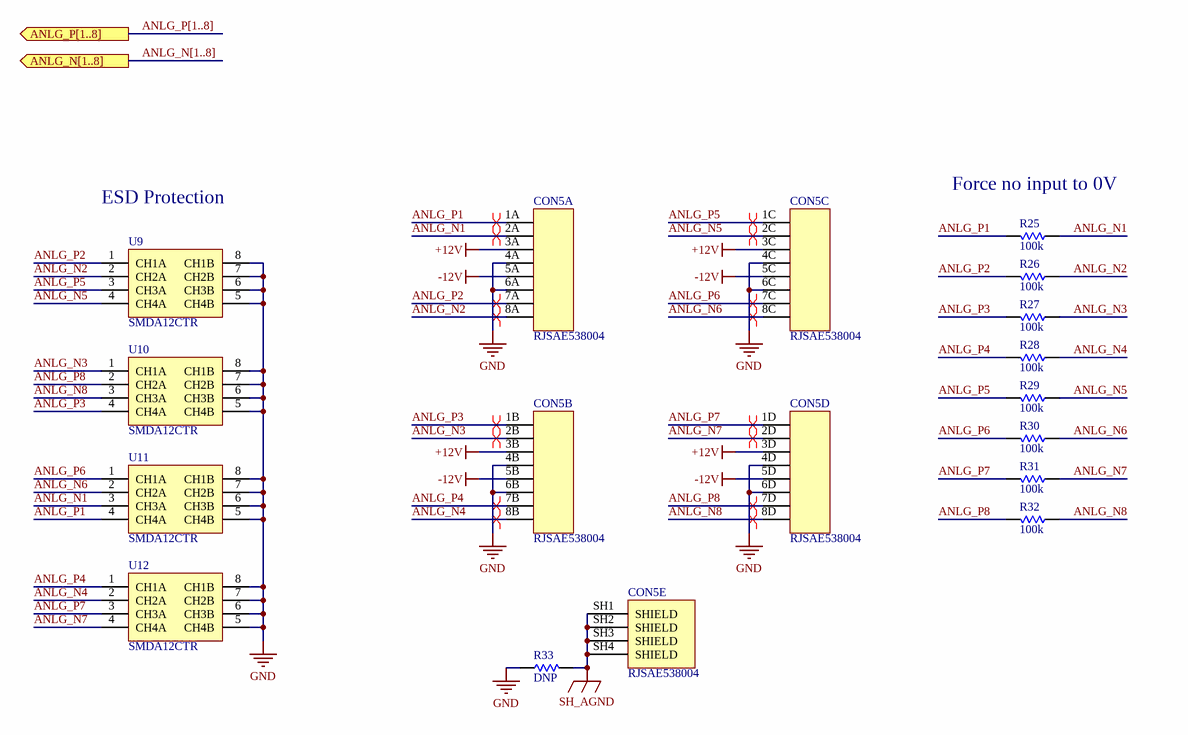
[diagram p17: AnalogConnectors.SchDoc]

### Parts
CON5  RJSAE538004  [RJSAE538004]  (parts A,B,C,D,E of 5)
R25  value 100k  [0603-RES]  (hidden comment: Resistor)
R26  value 100k  [0603-RES]  (hidden comment: Resistor)
R27  value 100k  [0603-RES]  (hidden comment: Resistor)
R28  value 100k  [0603-RES]  (hidden comment: Resistor)
R29  value 100k  [0603-RES]  (hidden comment: Resistor)
R30  value 100k  [0603-RES]  (hidden comment: Resistor)
R31  value 100k  [0603-RES]  (hidden comment: Resistor)
R32  value 100k  [0603-RES]  (hidden comment: Resistor)
R33  value DNP  [0603-RES]  (hidden comment: Resistor)
U9  SMDA12CTR  [SOIC127P600X175-8N]
U10  SMDA12CTR  [SOIC127P600X175-8N]
U11  SMDA12CTR  [SOIC127P600X175-8N]
U12  SMDA12CTR  [SOIC127P600X175-8N]

### Ports
ANLG_N[1..8] (out), ANLG_P[1..8] (out)

### Nets
+12V: CON5.3A CON5.3B CON5.3C CON5.3D
-12V: CON5.5A CON5.5B CON5.5C CON5.5D
GND: CON5.4A CON5.4B CON5.4C CON5.4D CON5.6A CON5.6B CON5.6C CON5.6D R33.1 U9.5(CH4B) U9.6(CH3B) U9.7(CH2B) U9.8(CH1B) U10.5(CH4B) U10.6(CH3B) U10.7(CH2B) U10.8(CH1B) U11.5(CH4B) U11.6(CH3B) U11.7(CH2B) U11.8(CH1B) U12.5(CH4B) U12.6(CH3B) U12.7(CH2B) U12.8(CH1B)
SH_AGND: CON5.SH1(SHIELD) CON5.SH2(SHIELD) CON5.SH3(SHIELD) CON5.SH4(SHIELD) R33.2
ANLG_N1: CON5.2A R25.1 U11.3(CH3A)
ANLG_N2: CON5.8A R26.1 U9.2(CH2A)
ANLG_N3: CON5.2B R27.1 U10.1(CH1A)
ANLG_N4: CON5.8B R28.1 U12.2(CH2A)
ANLG_N5: CON5.2C R29.1 U9.4(CH4A)
ANLG_N6: CON5.8C R30.1 U11.2(CH2A)
ANLG_N7: CON5.2D R31.1 U12.4(CH4A)
ANLG_N8: CON5.8D R32.1 U10.3(CH3A)
ANLG_P1: CON5.1A R25.2 U11.4(CH4A)
ANLG_P2: CON5.7A R26.2 U9.1(CH1A)
ANLG_P3: CON5.1B R27.2 U10.4(CH4A)
ANLG_P4: CON5.7B R28.2 U12.1(CH1A)
ANLG_P5: CON5.1C R29.2 U9.3(CH3A)
ANLG_P6: CON5.7C R30.2 U11.1(CH1A)
ANLG_P7: CON5.1D R31.2 U12.3(CH3A)
ANLG_P8: CON5.7D R32.2 U10.2(CH2A)

### Buses and harness runs
bus ANLG_N[1..8] = port ANLG_N[1..8]
bus ANLG_P[1..8] = port ANLG_P[1..8]

### Layout directives
differential pair: ANLG_N1, ANLG_N2, ANLG_N3, ANLG_N4, ANLG_N5, ANLG_N6, ANLG_N7, ANLG_N8, ANLG_P1, ANLG_P2, ANLG_P3, ANLG_P4, ANLG_P5, ANLG_P6, ANLG_P7, ANLG_P8

### Notes on the sheet
- ESD Protection
- (near R25) Force no input to 0V
- Title:
- File:
- Sheet:
- of
- Revision:
- Time:
- Date:
- Engineer:

### Library data of the parts
CON5 = RJSAE538004: CONN MOD JACK 8P8C R/A SHIELDED; Supplier 1: Digi-Key; Supplier Part Number 1: RJSAE538004-ND
U9-U12 = SMDA12CTR: TVS DIODE 12V 19V 8SO; Supplier 1: Digi-Key; Supplier Part Number 1: 1655-1701-1-ND
R25-R33 = Resistor: Supplier 1: Digi-Key
  R25-R32: Supplier Part Number 1: 311-100KLDCT-ND
  R33: Supplier Part Number 1: P0.0GCT-ND

## Sheet AnalogConditioning.SchDoc: Analog Signal Conditioning
size Letter; Engineer: Nathan Petersen; DocumentNumber: 13; Revision: v1.2; SheetNumber: 13; SheetTotal: 26
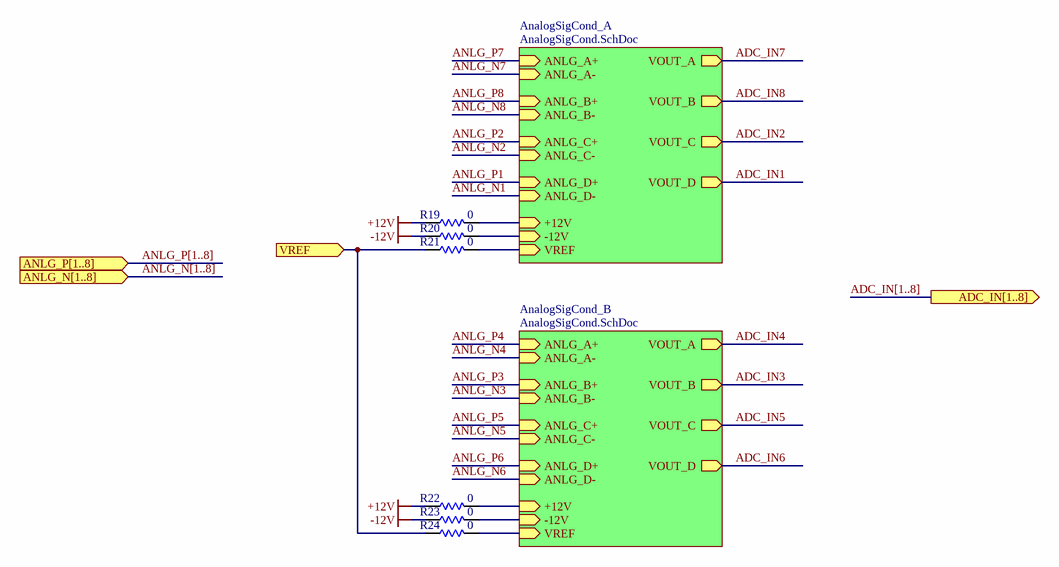
[diagram p18: AnalogConditioning.SchDoc]

### Parts
R19  value 0  [1206-RES]  (hidden comment: Resistor)
R20  value 0  [1206-RES]  (hidden comment: Resistor)
R21  value 0  [1206-RES]  (hidden comment: Resistor)
R22  value 0  [1206-RES]  (hidden comment: Resistor)
R23  value 0  [1206-RES]  (hidden comment: Resistor)
R24  value 0  [1206-RES]  (hidden comment: Resistor)

### Sub-sheets
AnalogSigCond_A = AnalogSigCond.SchDoc: +12V (in), -12V (in), VREF (in), ANLG_A+ (in), ANLG_A- (in), ANLG_B+ (in), ANLG_B- (in), ANLG_C+ (in), ANLG_C- (in), ANLG_D+ (in), ANLG_D- (in), VOUT_A (out), VOUT_B (out), VOUT_C (out), VOUT_D (out)
AnalogSigCond_B = AnalogSigCond.SchDoc: +12V (in), -12V (in), VREF (in), ANLG_A+ (in), ANLG_A- (in), ANLG_B+ (in), ANLG_B- (in), ANLG_C+ (in), ANLG_C- (in), ANLG_D+ (in), ANLG_D- (in), VOUT_A (out), VOUT_B (out), VOUT_C (out), VOUT_D (out)

### Ports
ADC_IN[1..8] (out), ANLG_N[1..8] (in), ANLG_P[1..8] (in), VREF (in)

### Nets
+12V: R19.1 R22.1
-12V: R20.1 R23.1
+12V: R19.2 ; sheet AnalogSigCond_A/+12V  [a separate net that carries the same name]
+12V: R22.2 ; sheet AnalogSigCond_B/+12V  [a separate net that carries the same name]
-12V: R20.2 ; sheet AnalogSigCond_A/-12V  [a separate net that carries the same name]
-12V: R23.2 ; sheet AnalogSigCond_B/-12V  [a separate net that carries the same name]
VREF: R21.2 ; sheet AnalogSigCond_A/VREF
VREF: R24.2 ; sheet AnalogSigCond_B/VREF  [a separate net that carries the same name]
NetR21_1: R21.1 R24.1 ; port VREF

### Buses and harness runs
bus ADC_IN[1..8] = port ADC_IN[1..8]
bus ANLG_N[1..8] = port ANLG_N[1..8]
bus ANLG_P[1..8] = port ANLG_P[1..8]

### Notes on the sheet
- Title:
- File:
- Sheet:
- of
- Revision:
- Time:
- Date:
- Engineer:

### Library data of the parts
R19-R24 = Resistor: Supplier 1: Digi-Key; Supplier Part Number 1: 311-0.0ERCT-ND

## Sheet AnalogSigCond.SchDoc: Analog Signal Front-End
size Letter; Engineer: Nathan Petersen; DocumentNumber: 14; Revision: v1.2; SheetNumber: 14; SheetTotal: 26
Used 2 times, as channels U_FPGA/U_AnalogInterface/U_AnalogConditioning/AnalogSigCond_A, U_FPGA/U_AnalogInterface/U_AnalogConditioning/AnalogSigCond_B. Parts and nets are listed once, with the designators drawn on the sheet.
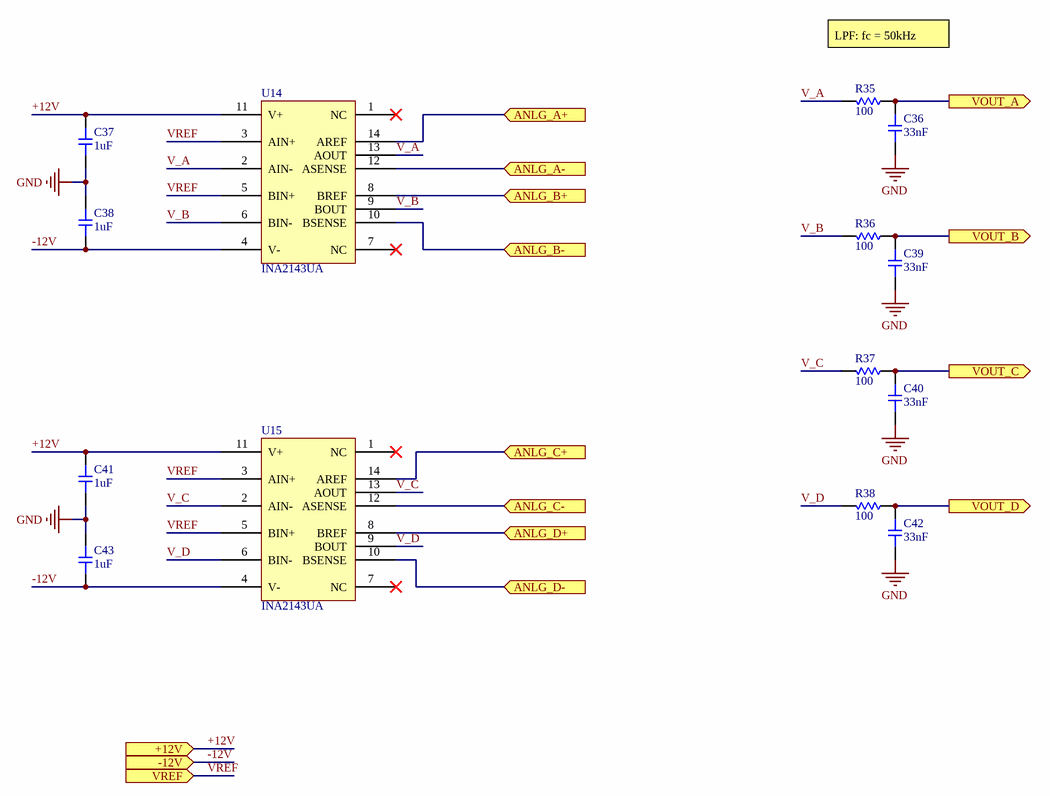
[diagram p19: AnalogSigCond.SchDoc]

### Parts
C36  value 33nF  [0603-CAP]  (hidden comment: Capacitor)
C37  value 1uF  [0603-CAP]  (hidden comment: Capacitor)
C38  value 1uF  [0603-CAP]  (hidden comment: Capacitor)
C39  value 33nF  [0603-CAP]  (hidden comment: Capacitor)
C40  value 33nF  [0603-CAP]  (hidden comment: Capacitor)
C41  value 1uF  [0603-CAP]  (hidden comment: Capacitor)
C42  value 33nF  [0603-CAP]  (hidden comment: Capacitor)
C43  value 1uF  [0603-CAP]  (hidden comment: Capacitor)
R35  value 100  [0603-RES]  (hidden comment: Resistor)
R36  value 100  [0603-RES]  (hidden comment: Resistor)
R37  value 100  [0603-RES]  (hidden comment: Resistor)
R38  value 100  [0603-RES]  (hidden comment: Resistor)
U14  INA2143UA  [SOIC127P600X175-14N]
U15  INA2143UA  [SOIC127P600X175-14N]

### Ports
+12V (in), -12V (in), ANLG_A+ (in), ANLG_A- (in), ANLG_B+ (in), ANLG_B- (in), ANLG_C+ (in), ANLG_C- (in), ANLG_D+ (in), ANLG_D- (in), VOUT_A (out), VOUT_B (out), VOUT_C (out), VOUT_D (out), VREF (in)

### Nets
GND: C36.2 C37.1 C38.2 C39.2 C40.2 C41.1 C42.2 C43.2
+12V: C37.2 C41.2 U14.11(V+) U15.11(V+) ; port +12V
-12V: C38.1 C43.1 U14.4(V-) U15.4(V-) ; port -12V
ANLG_A+: U14.14(AREF) ; port ANLG_A+
ANLG_A-: U14.12(ASENSE) ; port ANLG_A-
ANLG_B+: U14.8(BREF) ; port ANLG_B+
ANLG_B-: U14.10(BSENSE) ; port ANLG_B-
ANLG_C+: U15.14(AREF) ; port ANLG_C+
ANLG_C-: U15.12(ASENSE) ; port ANLG_C-
ANLG_D+: U15.8(BREF) ; port ANLG_D+
ANLG_D-: U15.10(BSENSE) ; port ANLG_D-
V_A: R35.2 U14.2(AIN-) U14.13(AOUT)
V_B: R36.2 U14.6(BIN-) U14.9(BOUT)
V_C: R37.2 U15.2(AIN-) U15.13(AOUT)
V_D: R38.2 U15.6(BIN-) U15.9(BOUT)
VOUT_A: C36.1 R35.1 ; port VOUT_A
VOUT_B: C39.1 R36.1 ; port VOUT_B
VOUT_C: C40.1 R37.1 ; port VOUT_C
VOUT_D: C42.1 R38.1 ; port VOUT_D
VREF: U14.3(AIN+) U14.5(BIN+) U15.3(AIN+) U15.5(BIN+) ; port VREF

Not connected (* = marked no-connect by the designer): U14 1(NC)* 7(NC)*; U15 1(NC)* 7(NC)*

### Channels
U_FPGA/U_AnalogInterface/U_AnalogConditioning/AnalogSigCond_A: designators end in A; ports +12V=+12V -12V=-12V ANLG_A+=ANLG_P7 ANLG_A-=ANLG_N7 ANLG_B+=ANLG_P8 ANLG_B-=ANLG_N8 ANLG_C+=ANLG_P2 ANLG_C-=ANLG_N2 ANLG_D+=ANLG_P1 ANLG_D-=ANLG_N1 VOUT_A=ADC_IN7 VOUT_B=ADC_IN8 VOUT_C=ADC_IN2 VOUT_D=ADC_IN1 VREF=VREF
U_FPGA/U_AnalogInterface/U_AnalogConditioning/AnalogSigCond_B: designators end in B; ports +12V=+12V -12V=-12V ANLG_A+=ANLG_P4 ANLG_A-=ANLG_N4 ANLG_B+=ANLG_P3 ANLG_B-=ANLG_N3 ANLG_C+=ANLG_P5 ANLG_C-=ANLG_N5 ANLG_D+=ANLG_P6 ANLG_D-=ANLG_N6 VOUT_A=ADC_IN4 VOUT_B=ADC_IN3 VOUT_C=ADC_IN5 VOUT_D=ADC_IN6 VREF=VREF

### Notes on the sheet
- LPF: fc = 50kHz
- Title:
- File:
- Sheet:
- of
- Revision:
- Time:
- Date:
- Engineer:

### Library data of the parts
U14 U15 = INA2143UA: IC OPAMP DIFF 150KHZ 14SOIC; Supplier 1: Digi-Key; Supplier Part Number 1: INA2143UA-ND
C36-C43 = Capacitor: Supplier 1: Digi-Key
  C36 C39 C40 C42: Supplier Part Number 1: 478-1548-1-ND
  C37 C38 C41 C43: Supplier Part Number 1: 1276-6524-1-ND
R35-R38 = Resistor: Supplier 1: Digi-Key; Supplier Part Number 1: YAG3561CT-ND

## Sheet Encoder.SchDoc: Encoders
size Letter; Engineer: Nathan Petersen; DocumentNumber: 21; Revision: v1.2; SheetNumber: 21; SheetTotal: 26
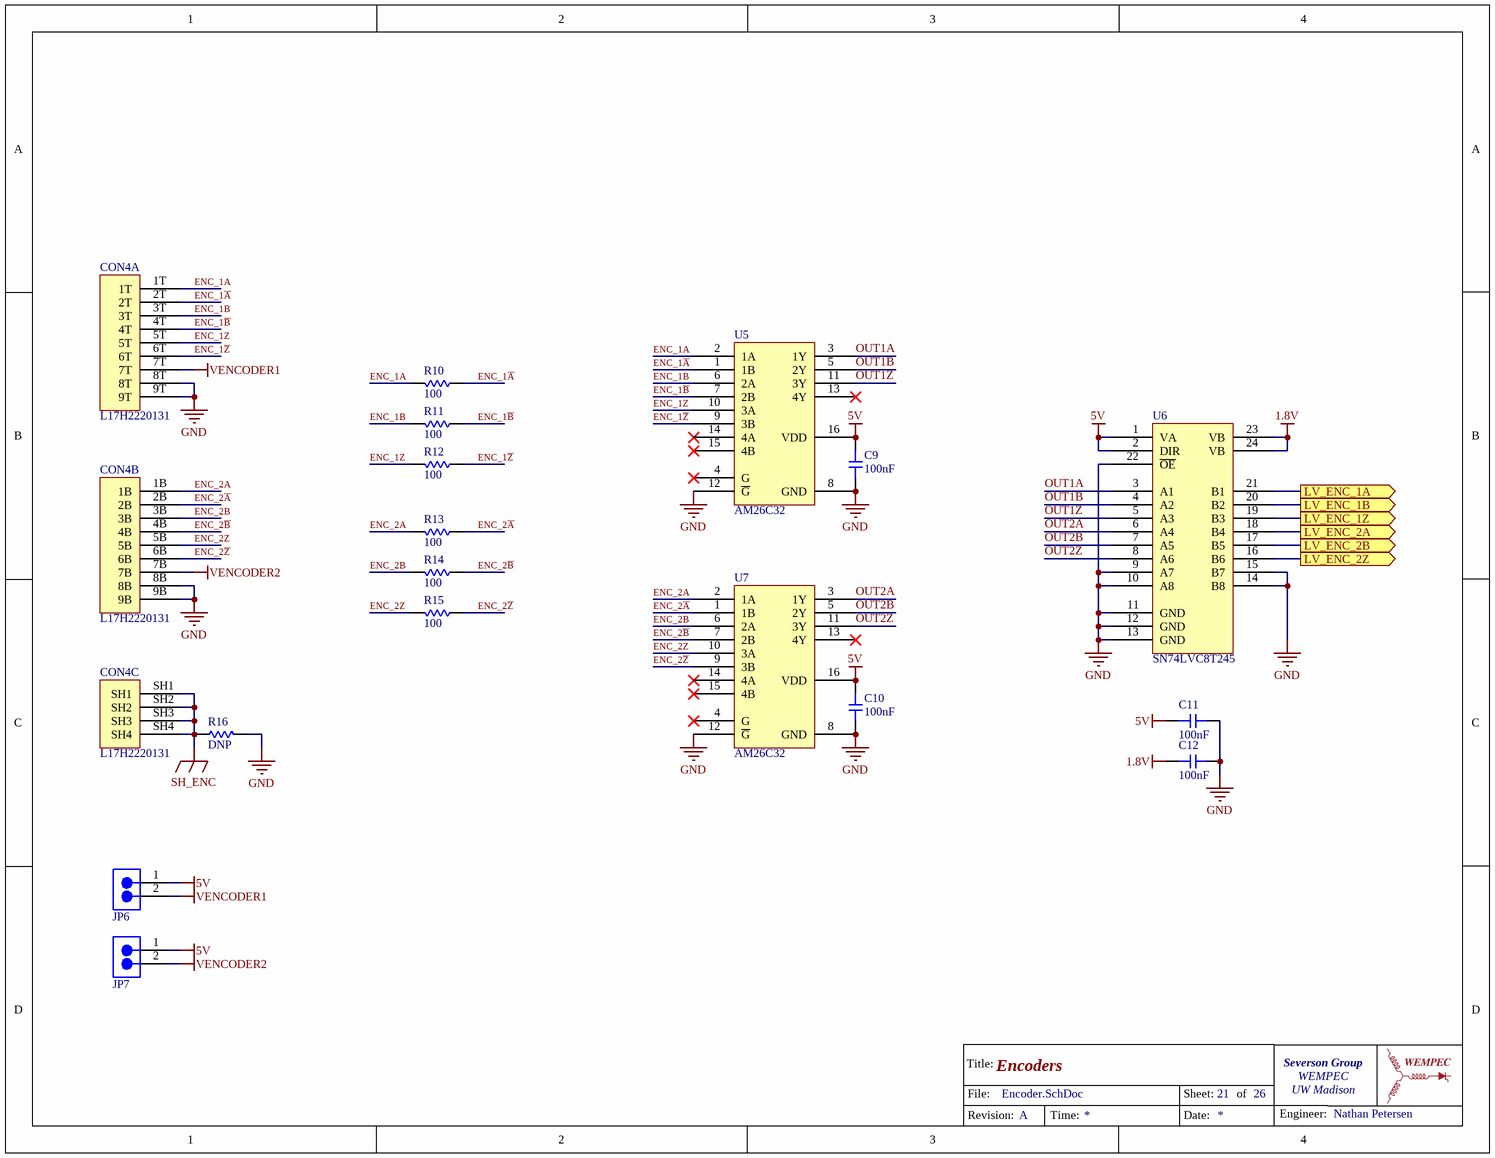
[diagram p20: Encoder.SchDoc]

### Parts
C9  value 100nF  [0603-CAP]  (hidden comment: Capacitor)
C10  value 100nF  [0603-CAP]  (hidden comment: Capacitor)
C11  value 100nF  [0603-CAP]  (hidden comment: Capacitor)
C12  value 100nF  [0603-CAP]  (hidden comment: Capacitor)
CON4  L17H2220131  [L17H2220131]  (parts A,B,C of 3)
JP6  Jumper2  [PIN_HEADER_1x2]  (value not drawn)
JP7  Jumper2  [PIN_HEADER_1x2]  (value not drawn)
R10  value 100  [0603-RES]  (hidden comment: Resistor)
R11  value 100  [0603-RES]  (hidden comment: Resistor)
R12  value 100  [0603-RES]  (hidden comment: Resistor)
R13  value 100  [0603-RES]  (hidden comment: Resistor)
R14  value 100  [0603-RES]  (hidden comment: Resistor)
R15  value 100  [0603-RES]  (hidden comment: Resistor)
R16  value DNP  [0603-RES]  (hidden comment: Resistor)
U5  AM26C32  [TSOP65P640X120-16N]
U6  SN74LVC8T245  [TSOP65P640X120-24N]
U7  AM26C32  [TSOP65P640X120-16N]

### Ports
LV_ENC_1A (out), LV_ENC_1B (out), LV_ENC_1Z (out), LV_ENC_2A (out), LV_ENC_2B (out), LV_ENC_2Z (out)

### Nets
1.8V: C12.1 U6.23(VB) U6.24(VB)
5V: C9.2 C10.2 C11.1 JP6.1 JP7.1 U5.16(VDD) U6.1(VA) U6.2(DIR) U7.16(VDD)
GND: C9.1 C10.1 C11.2 C12.2 CON4.8B CON4.8T CON4.9B CON4.9T R16.2 U5.8(GND) U5.12(~{G}) U6.9(A7) U6.10(A8) U6.11(GND) U6.12(GND) U6.13(GND) U6.14(B8) U6.15(B7) U6.22(~{OE}) U7.8(GND) U7.12(~{G})
SH_ENC: CON4.SH1 CON4.SH2 CON4.SH3 CON4.SH4 R16.1
VENCODER1: CON4.7T JP6.2
VENCODER2: CON4.7B JP7.2
ENC_1A: CON4.1T R10.2 U5.2(1A)
ENC_1~{A}: CON4.2T R10.1 U5.1(1B)
ENC_1B: CON4.3T R11.2 U5.6(2A)
ENC_1~{B}: CON4.4T R11.1 U5.7(2B)
ENC_1Z: CON4.5T R12.2 U5.10(3A)
ENC_1~{Z}: CON4.6T R12.1 U5.9(3B)
ENC_2A: CON4.1B R13.2 U7.2(1A)
ENC_2~{A}: CON4.2B R13.1 U7.1(1B)
ENC_2B: CON4.3B R14.2 U7.6(2A)
ENC_2~{B}: CON4.4B R14.1 U7.7(2B)
ENC_2Z: CON4.5B R15.2 U7.10(3A)
ENC_2~{Z}: CON4.6B R15.1 U7.9(3B)
LV_ENC_1A: U6.21(B1) ; port LV_ENC_1A
LV_ENC_1B: U6.20(B2) ; port LV_ENC_1B
LV_ENC_1Z: U6.19(B3) ; port LV_ENC_1Z
LV_ENC_2A: U6.18(B4) ; port LV_ENC_2A
LV_ENC_2B: U6.17(B5) ; port LV_ENC_2B
LV_ENC_2Z: U6.16(B6) ; port LV_ENC_2Z
OUT1A: U5.3(1Y) U6.3(A1)
OUT1B: U5.5(2Y) U6.4(A2)
OUT1Z: U5.11(3Y) U6.5(A3)
OUT2A: U6.6(A4) U7.3(1Y)
OUT2B: U6.7(A5) U7.5(2Y)
OUT2Z: U6.8(A6) U7.11(3Y)

Not connected (* = marked no-connect by the designer): U5 4(G)* 13(4Y)* 14(4A)* 15(4B)*; U7 4(G)* 13(4Y)* 14(4A)* 15(4B)*

### Notes on the sheet
- Title:
- File:
- Sheet:
- of
- Revision:
- Time:
- Date:
- Engineer:

### Library data of the parts
CON4 = L17H2220131: CONN D-SUB RCPT 9POS R/A SLDR; Supplier 1: Digi-Key; Supplier Part Number 1: L17H2220131-ND
U5 U7 = AM26C32: IC RCVR RS422 QUAD DIFF 16TSSOP; Supplier 1: Digi-Key; Supplier Part Number 1: 296-30088-1-ND
U6 = SN74LVC8T245PWR: IC BUS TRANSCVR 8BIT 24TSSOP; Supplier 1: Digi-Key; Supplier Part Number 1: 296-18593-1-ND
C9-C12 = Capacitor: Supplier 1: Digi-Key; Supplier Part Number 1: 1276-1012-1-ND
JP6 JP7 = Jumper2: Supplier 1: Digi-Key; Supplier Part Number 1: 732-5315-ND
R10-R16 = Resistor: Supplier 1: Digi-Key
  R10-R15: Supplier Part Number 1: YAG3561CT-ND
  R16: Supplier Part Number 1: P0.0GCT-ND

## Sheet FPGA_IO.SchDoc: FPGA I/O Interface
size 279 x 215 mm; Engineer: Prasoon Sinha; DocumentNumber: 22; SheetNumber: 22; SheetTotal: 26
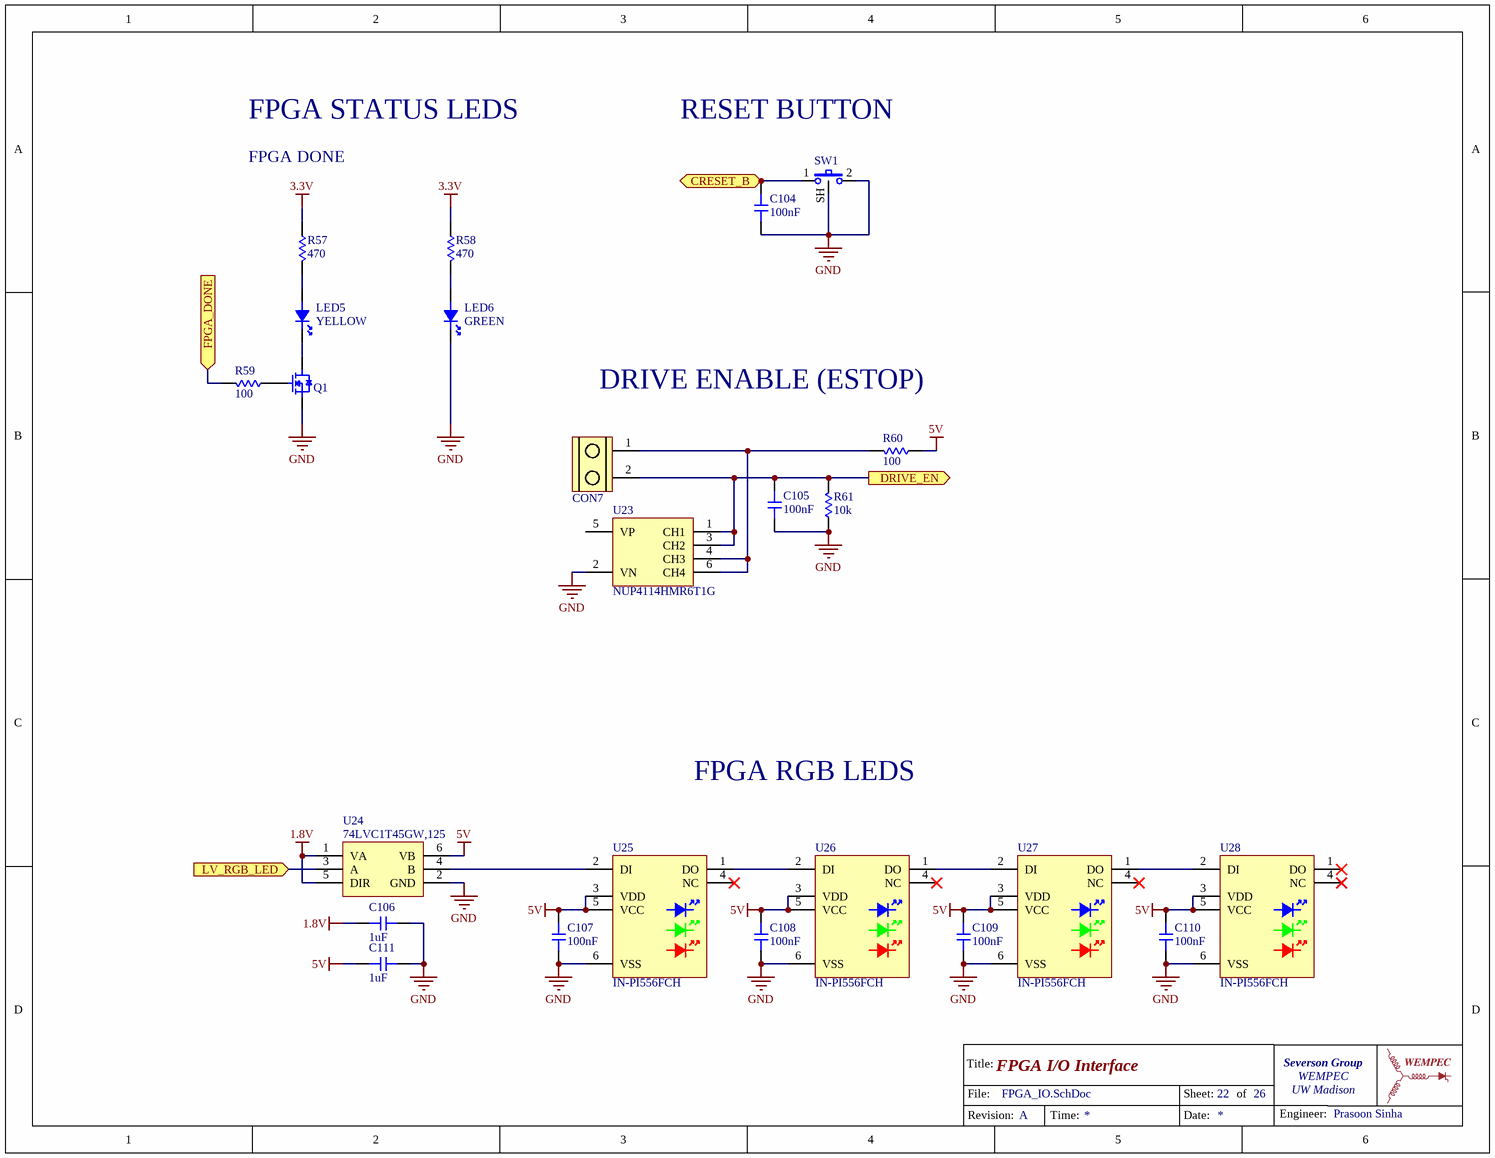
[diagram p21: FPGA_IO.SchDoc]

### Parts
(Parts that share a designator on the sheet are numbered #1, #2 ... from top to bottom, then left to right.)
*?#9  TitleBlockWEMPEC  (value not drawn)  (graphical)
C104  value 100nF  [0603-CAP]  (hidden comment: Capacitor)
C105  value 100nF  [0603-CAP]  (hidden comment: Capacitor)
C106  value 1uF  [0603-CAP]  (hidden comment: Capacitor)
C107  value 100nF  [0603-CAP]  (hidden comment: Capacitor)
C108  value 100nF  [0603-CAP]  (hidden comment: Capacitor)
C109  value 100nF  [0603-CAP]  (hidden comment: Capacitor)
C110  value 100nF  [0603-CAP]  (hidden comment: Capacitor)
C111  value 1uF  [0603-CAP]  (hidden comment: Capacitor)
CON7  ScrewTerminal_1x2  [1935161]  (value not drawn)
LED5  value YELLOW  [0603-LED]  (hidden comment: LED)
LED6  value GREEN  [0603-LED]  (hidden comment: LED)
Q1  MOSFET  [SOT95P245X110-3N]  (value not drawn)
R57  value 470  [0603-RES]  (hidden comment: Resistor)
R58  value 470  [0603-RES]  (hidden comment: Resistor)
R59  value 100  [0603-RES]  (hidden comment: Resistor)
R60  value 100  [0603-RES]  (hidden comment: Resistor)
R61  value 10k  [0603-RES]  (hidden comment: Resistor)
SW1  1825027-5  [1825027-5]  (value not drawn)
U23  NUP4114HMR6T1G  [TSOP95P280X110-6N]
U24  74LVC1T45GW,125  [SOT95P280X145-6N]
U25  IN-PI556FCH  [IN-PI556FCH]
U26  IN-PI556FCH  [IN-PI556FCH]
U27  IN-PI556FCH  [IN-PI556FCH]
U28  IN-PI556FCH  [IN-PI556FCH]

### Ports
CRESET_B (bidir), DRIVE_EN (out), FPGA_DONE (in), LV_RGB_LED (in)

### Nets
1.8V: C106.1 U24.1(VA) U24.5(DIR)
3.3V: R57.1 R58.1
5V: C107.2 C108.2 C109.2 C110.2 C111.1 R60.1 U24.6(VB) U25.3(VDD) U25.5(VCC) U26.3(VDD) U26.5(VCC) U27.3(VDD) U27.5(VCC) U28.3(VDD) U28.5(VCC)
GND: C104.1 C105.1 C106.2 C107.1 C108.1 C109.1 C110.1 C111.2 LED6.C Q1.2(S) R61.1 SW1.2 SW1.SH U23.2(VN) U24.2(GND) U25.6(VSS) U26.6(VSS) U27.6(VSS) U28.6(VSS)
CDONE: R59.2 ; port FPGA_DONE
CRESET_B: C104.2 SW1.1 ; port CRESET_B
DRIVE_EN: C105.2 CON7.2 R61.2 U23.1(CH1) U23.3(CH2) ; port DRIVE_EN
LV_RGB_LED: U24.3(A) ; port LV_RGB_LED
NetCON7_1: CON7.1 R60.2 U23.4(CH3) U23.6(CH4)
NetLED5_A: LED5.A R57.2
NetLED5_C: LED5.C Q1.3(D)
NetLED6_A: LED6.A R58.2
NetQ1_1: Q1.1(G) R59.1
NetU24_4: U24.4(B) U25.2(DI)
NetU25_1: U25.1(DO) U26.2(DI)
NetU26_1: U26.1(DO) U27.2(DI)
NetU27_1: U27.1(DO) U28.2(DI)

Not connected (* = marked no-connect by the designer): U23 5(VP); U25 4(NC)*; U26 4(NC)*; U27 4(NC)*; U28 1(DO)* 4(NC)*

### Notes on the sheet
- FPGA STATUS LEDS
- FPGA DONE
- RESET BUTTON
- DRIVE ENABLE (ESTOP)
- FPGA RGB LEDS
- (in symbol TitleBlockWEMPEC) Title:; File:; Sheet:; of; Engineer:; Revision:; Time:; Date:

### Library data of the parts
SW1 = 1825027-5: SWITCH TACTILE SPST-NO 0.05A 24V; Supplier 1: Digi-Key; Supplier Part Number 1: 450-1662-ND
U23 = NUP4114HMR6T1G: TVS DIODE 5.5V 10V 6TSOP; Supplier 1: Digi-Key; Supplier Part Number 1: NUP4114HMR6T1GOSCT-ND
U24 = 74LVC1T45GW,125: TXRX XLATING DUAL 3ST 6TSSOP; Supplier 1: Digi-Key; Supplier Part Number 1: 1727-4560-1-ND
U25-U28 = IN-PI556FCH: LED RGB 5050 SMD; Supplier 1: Digi-Key; Supplier Part Number 1: 1830-1107-1-ND
C104-C111 = Capacitor: Supplier 1: Digi-Key
  C104 C105 C107-C110: Supplier Part Number 1: 1276-1012-1-ND
  C106 C111: Supplier Part Number 1: 1276-6524-1-ND
CON7 = ScrewTerminal_1x2: Supplier 1: Digi-Key; Supplier Part Number 1: 277-1667-ND
LED5 LED6 = LED: Supplier 1: Digi-Key
  LED5: Supplier Part Number 1: 160-1448-1-ND
  LED6: Supplier Part Number 1: 160-1446-1-ND
Q1 = MOSFET: Supplier 1: Digi-Key; Supplier Part Number 1: FDV301NCT-ND
R57-R61 = Resistor: Supplier 1: Digi-Key
  R57 R58: Supplier Part Number 1: 541-4038-1-ND
  R59 R60: Supplier Part Number 1: YAG3561CT-ND
  R61: Supplier Part Number 1: P10.0KHCT-ND

## Sheet Power.SchDoc: Power
size 279 x 215 mm; Engineer: Prasoon Sinha; DocumentNumber: 23; SheetNumber: 23; SheetTotal: 26
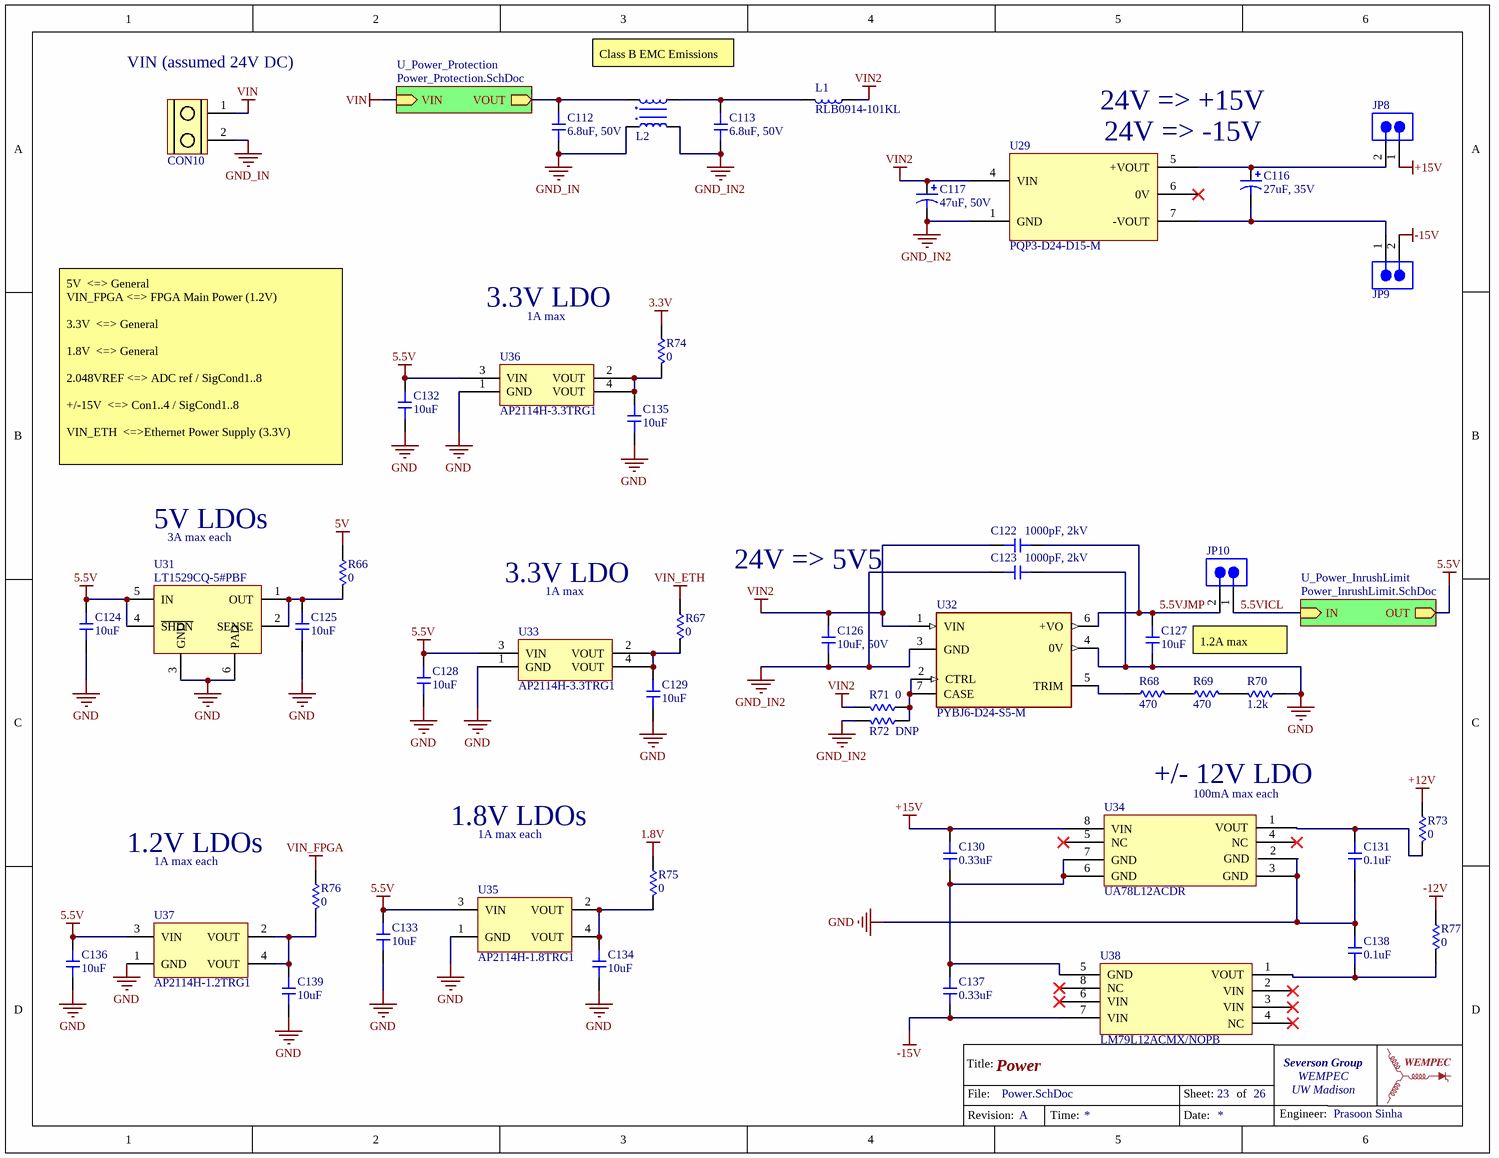
[diagram p22: Power.SchDoc]

### Parts
(Parts that share a designator on the sheet are numbered #1, #2 ... from top to bottom, then left to right.)
*?#10  TitleBlockWEMPEC  (value not drawn)  (graphical)
C112  value 6.8uF, 50V  [1812-CAP]  (hidden comment: Capacitor)
C113  value 6.8uF, 50V  [1812-CAP]  (hidden comment: Capacitor)
C116  value 27uF, 35V  [EEV336M035A9GAA]  (hidden comment: Cap Pol1)
C117  value 47uF, 50V  [EDH476M050A9HAA]  (hidden comment: Cap Pol1)
C122  value 1000pF, 2kV  [1808-CAP]  (hidden comment: Capacitor)
C123  value 1000pF, 2kV  [1808-CAP]  (hidden comment: Capacitor)
C124  value 10uF  [0603-CAP]  (hidden comment: Capacitor)
C125  value 10uF  [0603-CAP]  (hidden comment: Capacitor)
C126  value 10uF, 50V  [0805 Cap]  (hidden comment: Capacitor)
C127  value 10uF  [0603-CAP]  (hidden comment: Capacitor)
C128  value 10uF  [0603-CAP]  (hidden comment: Capacitor)
C129  value 10uF  [0603-CAP]  (hidden comment: Capacitor)
C130  value 0.33uF  [0603-CAP]  (hidden comment: Capacitor)
C131  value 0.1uF  [0603-CAP]  (hidden comment: Capacitor)
C132  value 10uF  [0603-CAP]  (hidden comment: Capacitor)
C133  value 10uF  [0603-CAP]  (hidden comment: Capacitor)
C134  value 10uF  [0603-CAP]  (hidden comment: Capacitor)
C135  value 10uF  [0603-CAP]  (hidden comment: Capacitor)
C136  value 10uF  [0603-CAP]  (hidden comment: Capacitor)
C137  value 0.33uF  [0603-CAP]  (hidden comment: Capacitor)
C138  value 0.1uF  [0603-CAP]  (hidden comment: Capacitor)
C139  value 10uF  [0603-CAP]  (hidden comment: Capacitor)
CON10  ScrewTerminal_1x2  [1935161]  (value not drawn)
JP8  Jumper2  [PIN_HEADER_1x2]  (value not drawn)
JP9  Jumper2  [PIN_HEADER_1x2]  (value not drawn)
JP10  Jumper2  [PIN_HEADER_1x2]  (value not drawn)
L1  RLB0914-101KL  [RLB0914]
L2  CMC  744273801  [CMC 744273801]  (value not drawn)
R66  value 0  [1206-RES]  (hidden comment: Resistor)
R67  value 0  [1206-RES]  (hidden comment: Resistor)
R68  value 470  [0603-RES]  (hidden comment: Resistor)
R69  value 470  [0603-RES]  (hidden comment: Resistor)
R70  value 1.2k  [0603-RES]  (hidden comment: Resistor)
R71  value 0  [1206-RES]  (hidden comment: Resistor)
R72  value DNP  [1206-RES]  (hidden comment: Resistor)
R73  value 0  [1206-RES]  (hidden comment: Resistor)
R74  value 0  [1206-RES]  (hidden comment: Resistor)
R75  value 0  [1206-RES]  (hidden comment: Resistor)
R76  value 0  [1206-RES]  (hidden comment: Resistor)
R77  value 0  [1206-RES]  (hidden comment: Resistor)
U29  PQP3-D24-D15-M  [CONV_PQP3-D24-D15-M]
U31  LT1529CQ-5#PBF  [5-DDPAK]
U32  PYBJ6-D24-S5-M  [CONV_PYBJ6-D24-S5-M]
U33  AP2114H-3.3TRG1  [SOT230P700X180-4N]
U34  UA78L12ACDR  [SOIC127P599X175-8N]
U35  AP2114H-1.8TRG1  [SOT230P700X180-4N]
U36  AP2114H-3.3TRG1  [SOT230P700X180-4N]
U37  AP2114H-1.2TRG1  [SOT230P700X180-4N]
U38  LM79L12ACMX/NOPB  [SOIC127P599X175-8N]

### Sub-sheets
U_Power_InrushLimit = Power_InrushLimit.SchDoc: IN (in), OUT (out)
U_Power_Protection = Power_Protection.SchDoc: VIN (in), VOUT (out)

### Nets
1.8V: R75.1
3.3V: R74.1
5.5V: C124.1 C128.1 C132.1 C133.1 C136.1 U31.4(~{SHDN}) U31.5(IN) U33.3(VIN) U35.3(VIN) U36.3(VIN) U37.3(VIN) ; sheet U_Power_InrushLimit/OUT
5V: R66.1
+12V: R73.1
+15V: C130.1 JP8.1 U34.8(VIN)
-12V: R77.1
-15V: C137.2 JP9.2 U38.7(VIN)
GND: C123.2 C124.2 C125.2 C127.1 C128.2 C129.2 C131.2 C132.2 C133.2 C134.2 C135.2 C136.2 C138.1 C139.2 R70.1 U31.3(GND) U31.6(PAD) U32.4(0V) U33.1(GND) U34.2(GND) U34.3(GND) U35.1(GND) U36.1(GND) U37.1(GND)
GND_IN: C112.1 CON10.2 L2.2
GND_IN2: C113.1 C117.2 C123.1 C126.1 L2.3 R72.2 U29.1(GND) U32.3(GND)
VIN: CON10.1 ; sheet U_Power_Protection/VIN
VIN2: C117.1 C122.1 C126.2 L1.2 R71.2 U29.4(VIN) U32.1(VIN)
VIN_ETH: R67.1
VIN_FPGA: R76.1
5.5VICL: JP10.1 ; sheet U_Power_InrushLimit/IN
5.5VJMP: C122.2 C127.2 JP10.2 U32.6(+VO)
NetC112_2: C112.2 L2.1 ; sheet U_Power_Protection/VOUT
NetC113_2: C113.2 L1.1 L2.4
NetC116_1: C116.1 JP8.2 U29.5(+VOUT)
NetC116_2: C116.2 JP9.1 U29.7(-VOUT)
NetC125_1: C125.1 R66.2 U31.1(OUT) U31.2(SENSE)
NetC129_1: C129.1 R67.2 U33.2(VOUT) U33.4(VOUT)
NetC130_2: C130.2 C137.1 U34.6(GND) U34.7(GND) U38.5(GND)
NetC131_1: C131.1 R73.2 U34.1(VOUT)
NetC134_1: C134.1 R75.2 U35.2(VOUT) U35.4(VOUT)
NetC135_1: C135.1 R74.2 U36.2(VOUT) U36.4(VOUT)
NetC138_2: C138.2 R77.2 U38.1(VOUT)
NetC139_1: C139.1 R76.2 U37.2(VOUT) U37.4(VOUT)
NetR68_1: R68.1 U32.5(TRIM)
NetR68_2: R68.2 R69.1
NetR69_2: R69.2 R70.2
NetR71_1: R71.1 R72.1 U32.2(CTRL) U32.7(CASE)

Not connected (* = marked no-connect by the designer): U29 6(0V)*; U34 4(NC)* 5(NC)*; U38 2(VIN)* 3(VIN)* 4(NC)* 6(VIN)* 8(NC)*

### Notes on the sheet
- (near CON10) VIN (assumed 24V DC)
- Class B EMC Emissions
- 24V => +15V
- 24V => -15V
- 3.3V LDO
- 1A max
- 5V		<=> General
  VIN_FPGA	<=> FPGA Main Power (1.2V)
  3.3V		<=> General
  1.8V		<=> General
  2.048VREF	<=> ADC ref / SigCond1..8
  +/-15V		<=> Con1..4 / SigCond1..8
  VIN_ETH		<=>Ethernet Power Supply (3.3V)
- 5V LDOs
- 3A max each
- 24V => 5V5
- 1.2A max
- (near U34) +/- 12V LDO
- 1.2V LDOs
- 1.8V LDOs
- 1A max each
- (near U34) 100mA max each
- (in symbol TitleBlockWEMPEC) Title:; File:; Sheet:; of; Engineer:; Revision:; Time:; Date:

### Library data of the parts
C116 C117 = Cap Pol1: Polarized Capacitor (Radial); Supplier 1: Digi-Key
  C116: Supplier Part Number 1: 399-18141-1-ND
  C117: Supplier Part Number 1: 399-18135-1-ND
L1 = RLB0914-101KL: 100µH Unshielded Wirewound Inductor 1.1A 280mOhm Max Radial, Vertical Cylinder /; Supplier Part Number 1: RLB0914-101KL-ND
L2 = CMC  744273801: CMC 450UH 6.5A 2LN TH; Supplier 1: Digi-Key; Supplier Part Number 1: 732-2215-1-ND
U29 = PQP3-D24-D15-M: Isolated Module DC DC Converter 2 Output 15V -15V 100mA, 100mA 18V - 36V Input; Supplier Part Number 1: 102-PQP3-D24-D15-M-ND
U31 = LT1529CQ-5#PBF: IC REG LINEAR 5V 3A 5DDPAK; Supplier 1: Digi-Key; Supplier Part Number 1: LT1529CQ-5#PBF-ND
U32 = PYBJ6-D24-S5-M: Isolated Module DC DC Converter 1 Output 5V 1.2A 18V - 36V Input; Supplier Part Number 1: 102-6611-ND
U33 U36 = AP2114H-3.3TRG1: IC REG LINEAR 3.3V 1A SOT223; Supplier 1: Digi-Key; Supplier Part Number 1: AP2114H-3.3TRG1DICT-ND
U34 = UA78L12ACDR: Linear Voltage Regulator IC 1 Output 100mA 8-SOIC; Supplier Part Number 1: 296-15054-1-ND
U35 = AP2114H-1.8TRG1: Linear Voltage Regulator IC 1 Output 1A SOT-223; Supplier Part Number 1: AP2114H-1.8TRG1DICT-ND
U37 = AP2114H-1.2TRG1: IC REG LINEAR 1.2V 1A SOT223; Supplier Part Number 1: AP2114H-1.2TRG1DICT-ND
U38 = LM79L12ACMX/NOPB: Linear Voltage Regulator IC 1 Output 100mA 8-SOIC; Supplier Part Number 1: LM79L12ACMX/NOPBCT-ND
C112 C113 C122-C139 = Capacitor: Supplier 1: Digi-Key
  C112 C113: Supplier Part Number 1: 445-3919-1-ND
  C122 C123: Supplier Part Number 1: 709-1046-1-ND
  C124 C125 C128 C129 C132-C136 C139: Supplier Part Number 1: 1276-1192-1-ND
  C126: Supplier Part Number 1: 490-18663-1-ND
  C127: Supplier Part Number 1: 445-9015-1-ND
  C130 C137: Supplier Part Number 1: 1276-2048-1-ND
  C131 C138: Supplier Part Number 1: 1276-1012-1-ND
CON10 = ScrewTerminal_1x2: Supplier 1: Digi-Key; Supplier Part Number 1: 277-1667-ND
JP8-JP10 = Jumper2: Supplier 1: Digi-Key; Supplier Part Number 1: 732-5315-ND
R66-R77 = Resistor: Supplier 1: Digi-Key
  R66 R67 R71-R77: Supplier Part Number 1: 311-0.0ERCT-ND
  R68 R69: Supplier Part Number 1: 311-470LDCT-ND
  R70: Supplier Part Number 1: 311-1.20KHRCT-ND

## Sheet Power_Protection.SchDoc: Power Protection
size Letter; DrawnBy: Nathan Petersen; Engineer: Nathan Petersen; Organization: Altium Limited; Address1: L3, 12a Rodborough Rd; Address2: Frenchs Forest; Address3: NSW; Address4: Australia 2086; DocumentNumber: 25; Revision: v1.2; SheetNumber: 25; SheetTotal: 26
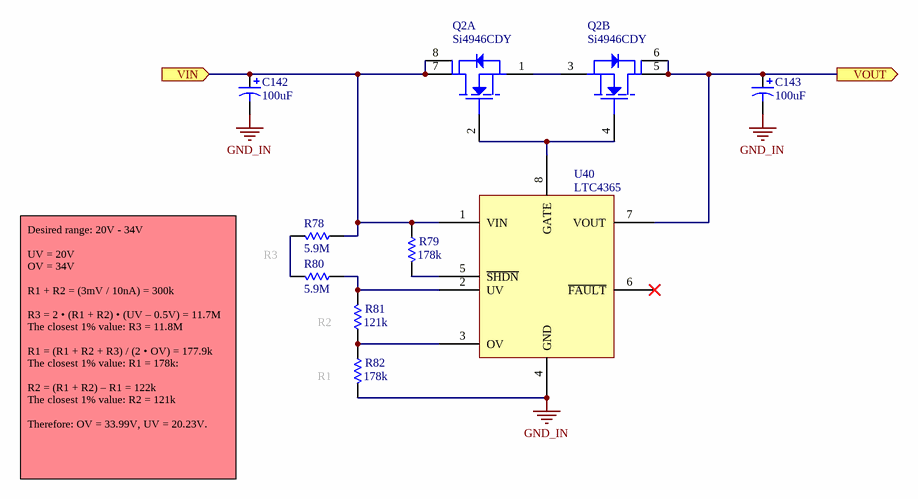
[diagram p23: Power_Protection.SchDoc]

### Parts
C142  value 100uF  [CAP - UWT1V101MCL1GS]  (hidden comment: Cap Pol1)
C143  value 100uF  [CAP - UWT1V101MCL1GS]  (hidden comment: Cap Pol1)
Q2  Si4946CDY  [SOIC127P600X175-8N]  (parts A,B of 2)
R78  value 5.9M  [0603-RES]  (hidden comment: Resistor)
R79  value 178k  [0603-RES]  (hidden comment: Resistor)
R80  value 5.9M  [0603-RES]  (hidden comment: Resistor)
R81  value 121k  [0603-RES]  (hidden comment: Resistor)
R82  value 178k  [0603-RES]  (hidden comment: Resistor)
U40  LTC4365  [TSOP65P280X100-8N]

### Ports
VIN (in), VOUT (out)

### Nets
GND_IN: C142.2 C143.2 R82.2 U40.4(GND)
VIN: C142.1 Q2.7(D1) Q2.8(D1) R78.1 R79.1 U40.1(VIN) ; port VIN
NetC112_2: C143.1 Q2.5(D2) Q2.6(D2) U40.7(VOUT) ; port VOUT
NetQ2_1: Q2.1(S1) Q2.3(S2)
NetQ2_2: Q2.2(G1) Q2.4(G2) U40.8(GATE)
NetR78_2: R78.2 R80.2
NetR79_2: R79.2 U40.5(~{SHDN})
NetR80_1: R80.1 R81.2 U40.2(UV)
NetR81_1: R81.1 R82.1 U40.3(OV)

Not connected (* = marked no-connect by the designer): U40 6(~{FAULT})*

### Notes on the sheet
- R3
- R2
- (near R82) R1
- Desired range: 20V - 34V
  UV = 20V
  OV = 34V
  R1 + R2 = (3mV / 10nA) = 300k
  R3 = 2 • (R1 + R2) • (UV – 0.5V) = 11.7M
  The closest 1% value: R3 = 11.8M
  R1 = (R1 + R2 + R3) / (2 • OV) = 177.9k
  The closest 1% value: R1 = 178k:
  R2 = (R1 + R2) – R1 = 122k
  The closest 1% value: R2 = 121k
  Therefore: OV = 33.99V, UV = 20.23V.
- Title:
- File:
- Sheet:
- of
- Revision:
- Time:
- Date:
- Engineer:

### Library data of the parts
C142 C143 = Cap Pol1: Polarized Capacitor (Radial); Supplier 1: Digi-Key; Supplier Part Number 1: 493-2203-1-ND
Q2 = SI4946CDY-T1-GE3: MOSFET N-CHAN DUAL 60V SO-8; Supplier 1: Digi-Key; Supplier Part Number 1: SI4946CDY-T1-GE3CT-ND
U40 = LTC4365CTS8#TRMPBF: IC OVERVOLTAGE PROT TSOT23-8; Supplier 1: Digi-Key; Supplier Part Number 1: LTC4365CTS8#TRMPBFCT-ND
R78-R82 = Resistor: Supplier 1: Digi-Key
  R78 R80: Supplier Part Number 1: 541-5.90MHCT-ND
  R79 R82: Supplier Part Number 1: 311-178KHRCT-ND
  R81: Supplier Part Number 1: 311-121KHRCT-ND

## Sheet Power_InrushLimit.SchDoc: Inrush Current Limiter
size Letter; Engineer: Nathan Petersen; DocumentNumber: 24; SheetNumber: 24; SheetTotal: 26
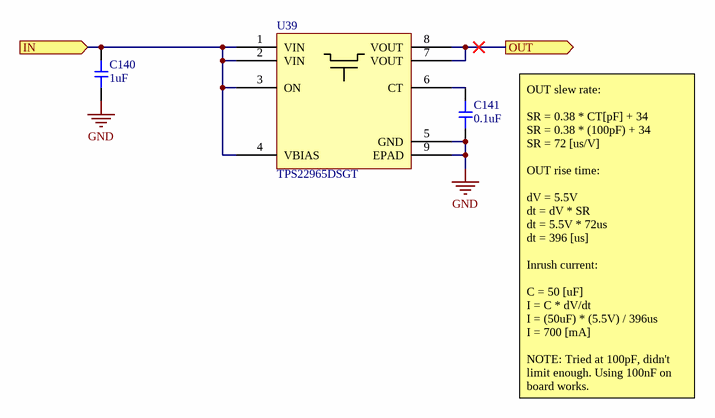
[diagram p24: Power_InrushLimit.SchDoc]

### Parts
C140  value 1uF  [0603-CAP]  (hidden comment: Capacitor)
C141  value 0.1uF  [0603-CAP]  (hidden comment: Capacitor)
U39  TPS22965DSGT  [SON50P200X80_HS-9N]

### Ports
IN (in), OUT (out)

### Nets
5.5V: U39.7(VOUT) U39.8(VOUT) ; port OUT
GND: C140.1 C141.1 U39.5(GND) U39.9(EPAD)
5.5VICL: C140.2 U39.1(VIN) U39.2(VIN) U39.3(ON) U39.4(VBIAS) ; port IN
NetC141_2: C141.2 U39.6(CT)

### Notes on the sheet
- OUT slew rate:
  SR = 0.38 * CT[pF] + 34
  SR = 0.38 * (100pF) + 34
  SR = 72 [us/V]
  OUT rise time:
  dV = 5.5V
  dt = dV * SR
  dt = 5.5V * 72us
  dt = 396 [us]
  Inrush current:
  C = 50 [uF]
  I = C * dV/dt
  I = (50uF) * (5.5V) / 396us
  I = 700 [mA]
  NOTE: Tried at 100pF, didn't limit enough. Using 100nF on board works.
- Title:
- File:
- Sheet:
- of
- Revision:
- Time:
- Date:
- Engineer:

### Library data of the parts
U39 = TPS22965DSGT: IC LOAD SWITCH 6A 8WSON; Supplier 1: Digi-Key; Supplier Part Number 1: 296-34943-1-ND
C140 C141 = Capacitor: Supplier 1: Digi-Key
  C140: Supplier Part Number 1: 1276-6524-1-ND
  C141: Supplier Part Number 1: 1276-1012-1-ND

## Sheet BackPage.SchDoc: Back Page
size Letter; Engineer: Nathan Petersen; DocumentNumber: 26; SheetNumber: 26; SheetTotal: 26
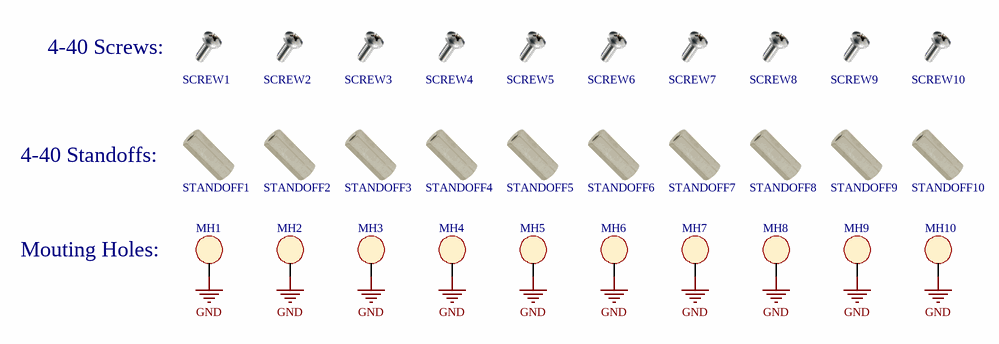
[diagram p25: BackPage.SchDoc]

### Parts
MH1  MOUNT_HOLE  [MOUNTING_HOLE]  (value not drawn)  (no BOM)
MH2  MOUNT_HOLE  [MOUNTING_HOLE]  (value not drawn)  (no BOM)
MH3  MOUNT_HOLE  [MOUNTING_HOLE]  (value not drawn)  (no BOM)
MH4  MOUNT_HOLE  [MOUNTING_HOLE]  (value not drawn)  (no BOM)
MH5  MOUNT_HOLE  [MOUNTING_HOLE]  (value not drawn)  (no BOM)
MH6  MOUNT_HOLE  [MOUNTING_HOLE]  (value not drawn)  (no BOM)
MH7  MOUNT_HOLE  [MOUNTING_HOLE]  (value not drawn)  (no BOM)
MH8  MOUNT_HOLE  [MOUNTING_HOLE]  (value not drawn)  (no BOM)
MH9  MOUNT_HOLE  [MOUNTING_HOLE]  (value not drawn)  (no BOM)
MH10  MOUNT_HOLE  [MOUNTING_HOLE]  (value not drawn)  (no BOM)
SCREW1  Screw-4-40  (value not drawn)  (mechanical)
SCREW2  Screw-4-40  (value not drawn)  (mechanical)
SCREW3  Screw-4-40  (value not drawn)  (mechanical)
SCREW4  Screw-4-40  (value not drawn)  (mechanical)
SCREW5  Screw-4-40  (value not drawn)  (mechanical)
SCREW6  Screw-4-40  (value not drawn)  (mechanical)
SCREW7  Screw-4-40  (value not drawn)  (mechanical)
SCREW8  Screw-4-40  (value not drawn)  (mechanical)
SCREW9  Screw-4-40  (value not drawn)  (mechanical)
SCREW10  Screw-4-40  (value not drawn)  (mechanical)
STANDOFF1  Standoff-4-40  (value not drawn)  (mechanical)
STANDOFF2  Standoff-4-40  (value not drawn)  (mechanical)
STANDOFF3  Standoff-4-40  (value not drawn)  (mechanical)
STANDOFF4  Standoff-4-40  (value not drawn)  (mechanical)
STANDOFF5  Standoff-4-40  (value not drawn)  (mechanical)
STANDOFF6  Standoff-4-40  (value not drawn)  (mechanical)
STANDOFF7  Standoff-4-40  (value not drawn)  (mechanical)
STANDOFF8  Standoff-4-40  (value not drawn)  (mechanical)
STANDOFF9  Standoff-4-40  (value not drawn)  (mechanical)
STANDOFF10  Standoff-4-40  (value not drawn)  (mechanical)

### Nets
GND: MH1.1 MH2.1 MH3.1 MH4.1 MH5.1 MH6.1 MH7.1 MH8.1 MH9.1 MH10.1

### Notes on the sheet
- (near SCREW1) 4-40 Screws:
- (near STANDOFF1) 4-40 Standoffs:
- Mouting Holes:
- Title:
- File:
- Sheet:
- of
- Revision:
- Time:
- Date:
- Engineer:

### Library data of the parts
MH1-MH10 = MOUNT_HOLE: MOUNTING HOLE
SCREW1-SCREW10 = Screw-4-40: Supplier 1: Digi-Key; Supplier Part Number 1: KEY1046-ND
STANDOFF1-STANDOFF10 = Standoff-4-40: Supplier 1: Digi-Key; Supplier Part Number 1: 36-1656-ND